# Altium project ECU V1.0 B.PrjPcb (part 6 of 9)
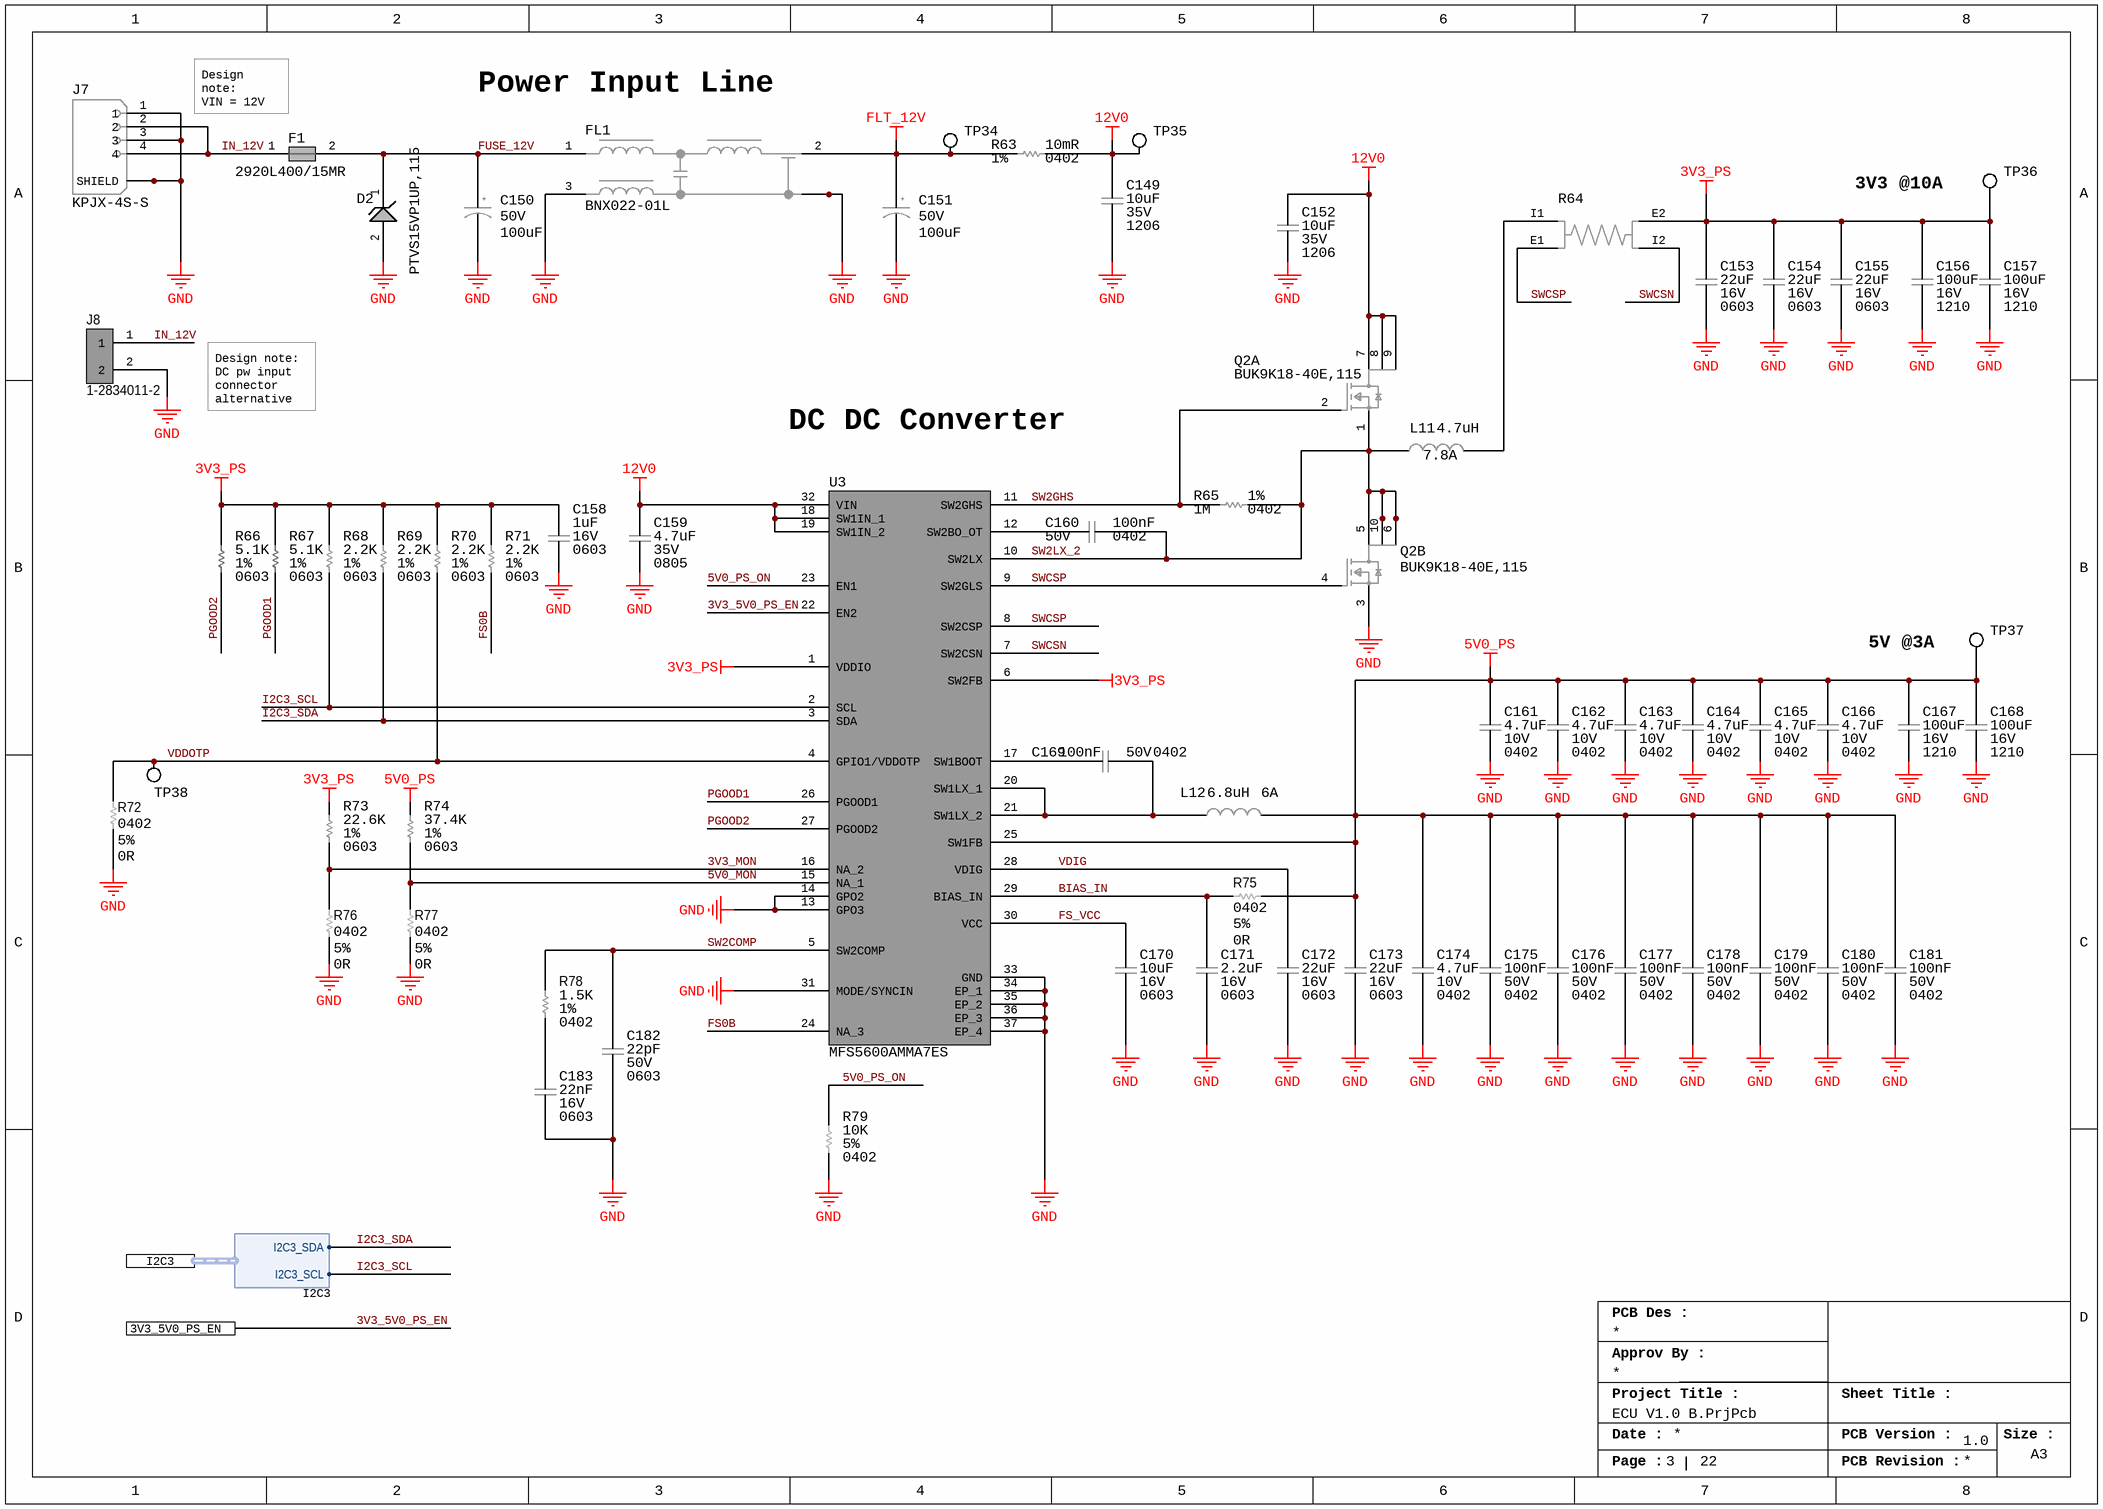
[diagram p16: 02_PWR IN.SchDoc]

## Sheet 02_PWR IN.SchDoc (continued)

### Library data of the parts (continued)
R74 = RES_37.4K_1%_100mW_0603: SMD Chip Resistor, 37.4 kOhm, ± 1%, 100 mW, 0603 [1608 Metric], Thick Film, General Purpose; Manufacturer: Yageo; Power Rating: 100mW; Voltage Rating: 50V; Temperature Coefficient: 100ppm/°C; Supplier 1: Digikey; Manufacturer Part Number: RC0603FR-0737K4L; RoHS: Yes; Category: Chip SMD Resistors; Stock 1: 85298; Pricing 1: 1=0.1, 10=0.009, 100=0.0071, 1000=0.00612 (USD); Case Code (Metric): 1608; Case Code (Imperial): 0603; Size Code: 0603; Min Operating Temperature: -55°C; Max Operating Temperature: 155°C; Package Quantity: 1; Packaging: Tape and Reel; Number of Terminations: 2; Termination: SMD/SMT; Max Power Dissipation: 100mW; Voltage Rating (DC): 50V; Features: Moisture Resistant; Series: RC; Length: 0.063inch; Width: 0.031inch; Height: 0.022inch; Lead Free: Lead Free; RoHS Compliant: Yes; ComponentLink1URL: https://datasheet.ciiva.com/2455/pyu-r-int-thick-7-2455137.pdf?src-supplier=Digikey; ComponentLink1Description: https://datasheet.ciiva.com/2455/pyu-r-int-thick-7-2455137.pdf?src-supplier=Digikey; ComponentLink2URL: https://datasheet.ciiva.com/2455/pyu-r-int-thick-7-2455138.pdf?src-supplier=Digikey; ComponentLink2Description: https://datasheet.ciiva.com/2455/pyu-r-int-thick-7-2455138.pdf?src-supplier=Digikey; ComponentLink3URL: https://datasheet.ciiva.com/2455/pyu-r-int-thick-7-2455139.pdf?src-supplier=Digikey; ComponentLink3Description: https://datasheet.ciiva.com/2455/pyu-r-int-thick-7-2455139.pdf?src-supplier=Digikey; Supplier Part Number 1: 311-37.4KHRDKR-ND
R78 = RES_1.5K_1%_63mW_0402: Res Thick Film 0402 1.5K Ohm 1% 1/16W ±100ppm/°C Molded SMD SMD Paper Tape on Plastic Reel; Manufacturer: Bourns; Power Rating: 62.5mW; Voltage Rating: 50V; Max Power Dissipation: 63mW; Supplier 1: Digi-Key; Manufacturer Part Number: CR0402-FX-1501GLF; RoHS: Yes; Category: Chip SMD Resistors; Stock 1: 177147; Pricing 1: 1=0.1, 10=0.011, 50=0.0064, 100=0.0051, 500=0.00326, 1000=0.00275, 5000=0.0019 (USD); Mount: Surface Mount; Case Code (Metric): 1005; Case Code (Imperial): 0402; Contact Plating: Tin; Min Operating Temperature: -55°C; Max Operating Temperature: 125°C; Package Quantity: 10000; Packaging: Tape and Reel; Number of Terminations: 2; Termination: SMD/SMT; Temperature Coefficient: 100ppm/°C; Series: CR0402; Voltage Rating (DC): 50V; Length: 0.039inch; Width: 0.5mm; Height: 0.016inch; Thickness: 356um; Radiation Hardening: No; RoHS Compliant: Yes; ComponentLink1URL: https://datasheet.ciiva.com/9123/cr0402-9123423.pdf?src-supplier=Avnet; ComponentLink1Description: https://datasheet.ciiva.com/9123/cr0402-9123423.pdf?src-supplier=Avnet; ComponentLink2URL: https://datasheet.ciiva.com/30173/cr0402-30173227.pdf?src-supplier=Onlinecomponents.com; ComponentLink2Description: https://datasheet.ciiva.com/30173/cr0402-30173227.pdf?src-supplier=Onlinecomponents.com; Supplier Part Number 1: CR0402-FX-1501GLFCT-ND
R79 = RES_10K_5%_100mW_0402: Res Thick Film 0402 10K Ohm 5% 1/10W ±200ppm/°C Molded SMD Punched Carrier T/R; Manufacturer: Panasonic; Power Rating: 100mW; Voltage Rating: 50V; Supplier 1: Digi-Key; Manufacturer Part Number: ERJ-2GEJ103X; RoHS: Yes; Category: Chip SMD Resistors; Stock 1: 4696986; Pricing 1: 1=0.1, 10=0.021, 50=0.0132, 100=0.011, 500=0.00744, 1000=0.00639, 5000=0.00464 (USD); Mount: Surface Mount; Contact Plating: Tin; Case Code (Metric): 1005; Case Code (Imperial): 0402; Size Code: 0402; Min Operating Temperature: -55°C; Max Operating Temperature: 155°C; Temperature Coefficient: 200ppm/°C; Packaging: Cut Tape; Resistor Type: Thick Film; Package Quantity: 10000; Number of Terminations: 2; Termination: SMD/SMT; Max Power Dissipation: 100mW; Features: Automotive AEC-Q200; Series: ERJ; Resistance Tolerance: 5%; Technology: THICK FILM; Voltage Rating (DC): 50V; Length: 1mm; Width: 0.5mm; Height: 0.35mm; Depth: 0.5mm; Ratings: AEC-Q200; Radiation Hardening: No; Reach SVHC Compliant: No; RoHS Compliant: Yes; Lead Free: 5697LeadFree; ComponentLink1URL: https://datasheet.ciiva.com/27055/1935721-27055112.pdf?src-supplier=Jameco; ComponentLink1Description: https://datasheet.ciiva.com/27055/1935721-27055112.pdf?src-supplier=Jameco; ComponentLink2URL: https://datasheet.ciiva.com/11821/0900766b80f806dd-11821170.pdf?src-supplier=Rs; ComponentLink2Description: https://datasheet.ciiva.com/11821/0900766b80f806dd-11821170.pdf?src-supplier=Rs; ComponentLink3URL: https://datasheet.ciiva.com/43460/1678796-43460391.pdf?src-supplier=Farnell; ComponentLink3Description: https://datasheet.ciiva.com/43460/1678796-43460391.pdf?src-supplier=Farnell; ComponentLink4URL: https://datasheet.ciiva.com/22785/1678796-22785949.pdf?src-supplier=Farnell; ComponentLink4Description: https://datasheet.ciiva.com/22785/1678796-22785949.pdf?src-supplier=Farnell; ComponentLink5URL: https://datasheet.ciiva.com/46371/1678796-46371910.pdf?src-supplier=Element14; ComponentLink5Description: https://datasheet.ciiva.com/46371/1678796-46371910.pdf?src-supplier=Element14; ComponentLink6URL: https://datasheet.ciiva.com/28514/1678796-28514154.pdf?src-supplier=Element14; ComponentLink6Description: https://datasheet.ciiva.com/28514/1678796-28514154.pdf?src-supplier=Element14; ComponentLink7URL: https://datasheet.ciiva.com/24070/aoa0000ce1-37422-24070679.pdf?src-supplier=Mouser; ComponentLink7Description: https://datasheet.ciiva.com/24070/aoa0000ce1-37422-24070679.pdf?src-supplier=Mouser; ComponentLink8URL: https://datasheet.ciiva.com/16767/70260739-16767130.pdf?src-supplier=Allied+Electronics; ComponentLink8Description: https://datasheet.ciiva.com/16767/70260739-16767130.pdf?src-supplier=Allied+Electronics; ComponentLink9URL: https://datasheet.ciiva.com/16774/70260739-16774504.pdf?src-supplier=Allied+Electronics; ComponentLink9Description: https://datasheet.ciiva.com/16774/70260739-16774504.pdf?src-supplier=Allied+Electronics; ComponentLink10URL: https://datasheet.ciiva.com/9194/aoa0000ce1-9194140.pdf?src-supplier=Avnet; ComponentLink10Description: https://datasheet.ciiva.com/9194/aoa0000ce1-9194140.pdf?src-supplier=Avnet; Supplier Part Number 1: P10KJCT-ND
TP34-TP38 = TP_PAD_SMD_SMALL: Test Point, SMD pad, round, 1.5mm, 1.6mm, 3mm diameter
U3 = IC_REG_BUCK_MFS5600AMMA7ES: Power Management, 36 V, 2 Step-Down DC-DC Converters, 2 Regulated Outputs, 32 Pins, HVQFN-EP; Manufacturer: NXP Semiconductors; Supplier 1: Digikey; Manufacturer Part Number: MFS5600AMMA7ES; RoHS: No; Category: Power Management ICs; Stock 1: 26; Pricing 1: 1=4.59, 10=3.486, 25=3.21, 100=2.9069, 490=2.67757, 980=2.60545, 1470=2.56933, 2940=2.51636 (USD); Supplier Part Number 1: 568-MFS5600AMMA7ES-ND

## Sheet 07_iMX 8X_LPDDR4.SchDoc
size A3; SheetNumber: 8; SheetTotal: 22
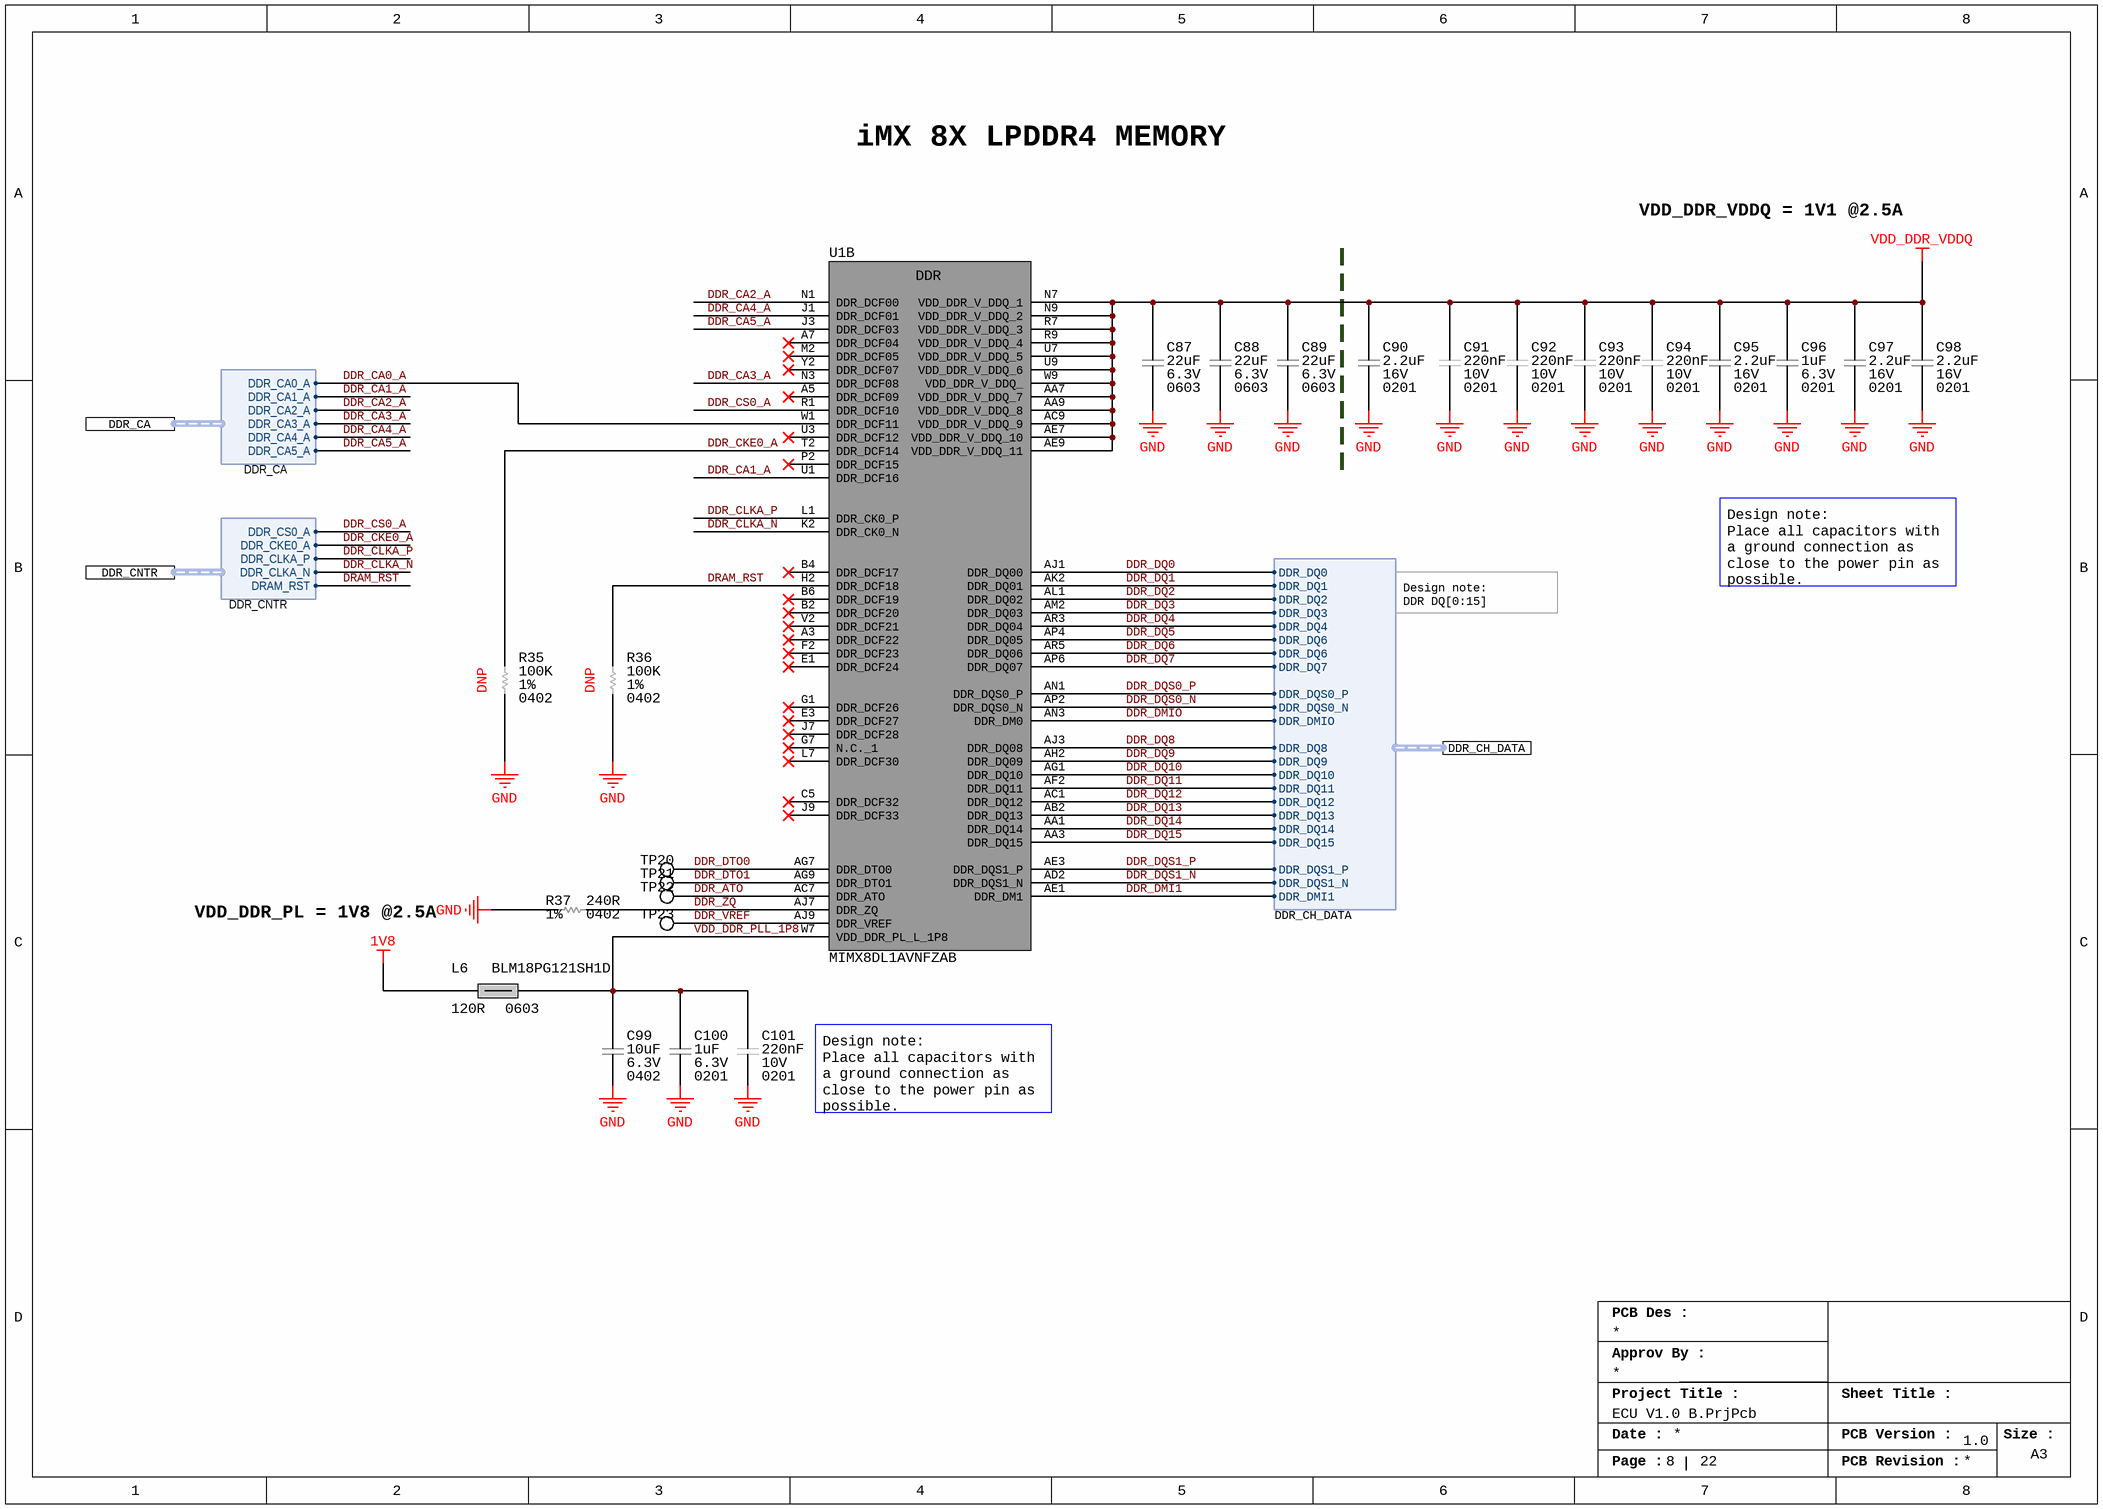
[diagram p6: 07_iMX 8X_LPDDR4.SchDoc]

### Parts
C87  Voltage Rating: 6.3V  Capacitance: 22uF  Case/Package: 0603  [CAP_0603_CAPC1608X08N]  (hidden comment: GRM188R60J226MEA0D)
C88  Voltage Rating: 6.3V  Capacitance: 22uF  Case/Package: 0603  [CAP_0603_CAPC1608X08N]  (hidden comment: GRM188R60J226MEA0D)
C89  Voltage Rating: 6.3V  Capacitance: 22uF  Case/Package: 0603  [CAP_0603_CAPC1608X08N]  (hidden comment: GRM188R60J226MEA0D)
C90  Capacitance: 2.2uF  Voltage Rating: 16V  Case/Package: 0201  [CAP_0201_CAPC0603X03N]  (hidden comment: GRM035R61C225ME01D)
C91  Voltage Rating (DC): 10V  Capacitance: 220nF  Case/Package: 0201  [CAP_0201_CAPC0603X03N]  (hidden comment: LMK063BJ224MP-F)
C92  Voltage Rating (DC): 10V  Capacitance: 220nF  Case/Package: 0201  [CAP_0201_CAPC0603X03N]  (hidden comment: LMK063BJ224MP-F)
C93  Voltage Rating (DC): 10V  Capacitance: 220nF  Case/Package: 0201  [CAP_0201_CAPC0603X03N]  (hidden comment: LMK063BJ224MP-F)
C94  Voltage Rating (DC): 10V  Capacitance: 220nF  Case/Package: 0201  [CAP_0201_CAPC0603X03N]  (hidden comment: LMK063BJ224MP-F)
C95  Capacitance: 2.2uF  Voltage Rating: 16V  Case/Package: 0201  [CAP_0201_CAPC0603X03N]  (hidden comment: GRM035R61C225ME01D)
C96  Voltage Rating (DC): 6.3V  Capacitance: 1uF  Case/Package: 0201  [CAP_0201_CAPC0603X03N]  (hidden comment: 02016D105MAT2A)
C97  Capacitance: 2.2uF  Voltage Rating: 16V  Case/Package: 0201  [CAP_0201_CAPC0603X03N]  (hidden comment: GRM035R61C225ME01D)
C98  Capacitance: 2.2uF  Voltage Rating: 16V  Case/Package: 0201  [CAP_0201_CAPC0603X03N]  (hidden comment: GRM035R61C225ME01D)
C99  Case/Package: 0402  Capacitance: 10uF  Voltage Rating: 6.3V  [CAP_0402_CAPC1005X05N]  (hidden comment: CL05A106MQ5NUNC)
C100  Voltage Rating (DC): 6.3V  Capacitance: 1uF  Case/Package: 0201  [CAP_0201_CAPC0603X03N]  (hidden comment: 02016D105MAT2A)
C101  Voltage Rating (DC): 10V  Capacitance: 220nF  Case/Package: 0201  [CAP_0201_CAPC0603X03N]  (hidden comment: LMK063BJ224MP-F)
L6  BLM18PG121SH1D  Impedance: 120R  Case/Package: 0603  [IND_0603_INDC1608X08N]
R35  Resistance: 100K  Tolerance: 1%  Case/Package: 0402  [RES_0402_RESC1005X04N]  (hidden comment: RC0402FR-07100KL)
R36  Resistance: 100K  Tolerance: 1%  Case/Package: 0402  [RES_0402_RESC1005X04N]  (hidden comment: RC0402FR-07100KL)
R37  Tolerance: 1%  Resistance: 240R  Case/Package: 0402  [RES_0402_RESC1005X04N]  (hidden comment: RC0402FR-07240RL)
TP20  NO COMPONENT  [TP_PAD_0.5MM_SMD_ROUND]  (value not drawn)  (no BOM)
TP21  NO COMPONENT  [TP_PAD_0.5MM_SMD_ROUND]  (value not drawn)  (no BOM)
TP22  NO COMPONENT  [TP_PAD_0.5MM_SMD_ROUND]  (value not drawn)  (no BOM)
TP23  NO COMPONENT  [TP_PAD_0.5MM_SMD_ROUND]  (value not drawn)  (no BOM)
U1  MIMX8DL1AVNFZAB  [MIMX8DL1AVNFZAB]  (part B of 15)

### Ports
DDR_CA (harness DDR_CA), DDR_CH_DATA (harness DDR_CH_DATA), DDR_CNTR (harness DDR_CNTR)

### Harnesses
DDR_CH_DATA: DDR_DQ0, DDR_DQ1, DDR_DQ2, DDR_DQ3, DDR_DQ4, DDR_DQ6, DDR_DQ6, DDR_DQ7, DDR_DQS0_P, DDR_DQS0_N, DDR_DMIO, DDR_DQ8, DDR_DQ9, DDR_DQ10, DDR_DQ11, DDR_DQ12, DDR_DQ13, DDR_DQ14, DDR_DQ15, DDR_DQS1_P, DDR_DQS1_N, DDR_DMI1
DDR_CA: DDR_CA0_A, DDR_CA1_A, DDR_CA2_A, DDR_CA3_A, DDR_CA4_A, DDR_CA5_A
DDR_CNTR: DDR_CS0_A, DDR_CKE0_A, DDR_CLKA_P, DDR_CLKA_N, DRAM_RST

### Nets
1V8: L6.1
GND: C87.1 C88.1 C89.1 C90.1 C91.1 C92.1 C93.1 C94.1 C95.1 C96.1 C97.1 C98.1 C99.1 C100.1 C101.1 R35.1 R36.1 R37.1
VDD_DDR_VDDQ: C87.2 C88.2 C89.2 C90.2 C91.2 C92.2 C93.2 C94.2 C95.2 C96.2 C97.2 C98.2 U1.AA7(VDD_DDR_V_DDQ_7) U1.AA9(VDD_DDR_V_DDQ_8) U1.AC9(VDD_DDR_V_DDQ_9) U1.AE7(VDD_DDR_V_DDQ_10) U1.AE9(VDD_DDR_V_DDQ_11) U1.N7(VDD_DDR_V_DDQ_1) U1.N9(VDD_DDR_V_DDQ_2) U1.R7(VDD_DDR_V_DDQ_3) U1.R9(VDD_DDR_V_DDQ_4) U1.U7(VDD_DDR_V_DDQ_5) U1.U9(VDD_DDR_V_DDQ_6) U1.W9(VDD_DDR_V_DDQ_)
DDR_ATO: TP22.1 U1.AC7(DDR_ATO)
DDR_CA0_A: U1.W1(DDR_DCF11) ; port DDR_CA.DDR_CA0_A
DDR_CA1_A: U1.U1(DDR_DCF16) ; port DDR_CA.DDR_CA1_A
DDR_CA2_A: U1.N1(DDR_DCF00) ; port DDR_CA.DDR_CA2_A
DDR_CA3_A: U1.N3(DDR_DCF08) ; port DDR_CA.DDR_CA3_A
DDR_CA4_A: U1.J1(DDR_DCF01) ; port DDR_CA.DDR_CA4_A
DDR_CA5_A: U1.J3(DDR_DCF03) ; port DDR_CA.DDR_CA5_A
DDR_CKE0_A: R35.2 U1.T2(DDR_DCF14) ; port DDR_CNTR.DDR_CKE0_A
DDR_CLKA_N: U1.K2(DDR_CK0_N) ; port DDR_CNTR.DDR_CLKA_N
DDR_CLKA_P: U1.L1(DDR_CK0_P) ; port DDR_CNTR.DDR_CLKA_P
DDR_CS0_A: U1.R1(DDR_DCF10) ; port DDR_CNTR.DDR_CS0_A
DDR_DMI1: U1.AE1(DDR_DM1) ; port DDR_CH_DATA.DDR_DMI1
DDR_DMIO: U1.AN3(DDR_DM0) ; port DDR_CH_DATA.DDR_DMIO
DDR_DQ0: U1.AJ1(DDR_DQ00) ; port DDR_CH_DATA.DDR_DQ0
DDR_DQ1: U1.AK2(DDR_DQ01) ; port DDR_CH_DATA.DDR_DQ1
DDR_DQ2: U1.AL1(DDR_DQ02) ; port DDR_CH_DATA.DDR_DQ2
DDR_DQ3: U1.AM2(DDR_DQ03) ; port DDR_CH_DATA.DDR_DQ3
DDR_DQ4: U1.AR3(DDR_DQ04) ; port DDR_CH_DATA.DDR_DQ4
DDR_DQ5: U1.AP4(DDR_DQ05) U1.AR5(DDR_DQ06) ; port DDR_CH_DATA.DDR_DQ6  [also labelled DDR_DQ6]
DDR_DQ7: U1.AP6(DDR_DQ07) ; port DDR_CH_DATA.DDR_DQ7
DDR_DQ8: U1.AJ3(DDR_DQ08) ; port DDR_CH_DATA.DDR_DQ8
DDR_DQ9: U1.AH2(DDR_DQ09) ; port DDR_CH_DATA.DDR_DQ9
DDR_DQ10: U1.AG1(DDR_DQ10) ; port DDR_CH_DATA.DDR_DQ10
DDR_DQ11: U1.AF2(DDR_DQ11) ; port DDR_CH_DATA.DDR_DQ11
DDR_DQ12: U1.AC1(DDR_DQ12) ; port DDR_CH_DATA.DDR_DQ12
DDR_DQ13: U1.AB2(DDR_DQ13) ; port DDR_CH_DATA.DDR_DQ13
DDR_DQ14: U1.AA1(DDR_DQ14) ; port DDR_CH_DATA.DDR_DQ14
DDR_DQ15: U1.AA3(DDR_DQ15) ; port DDR_CH_DATA.DDR_DQ15
DDR_DQS0_N: U1.AP2(DDR_DQS0_N) ; port DDR_CH_DATA.DDR_DQS0_N
DDR_DQS0_P: U1.AN1(DDR_DQS0_P) ; port DDR_CH_DATA.DDR_DQS0_P
DDR_DQS1_N: U1.AD2(DDR_DQS1_N) ; port DDR_CH_DATA.DDR_DQS1_N
DDR_DQS1_P: U1.AE3(DDR_DQS1_P) ; port DDR_CH_DATA.DDR_DQS1_P
DDR_DTO0: TP20.1 U1.AG7(DDR_DTO0)
DDR_DTO1: TP21.1 U1.AG9(DDR_DTO1)
DDR_VREF: TP23.1 U1.AJ9(DDR_VREF)
DDR_ZQ: R37.2 U1.AJ7(DDR_ZQ)
DRAM_RST: R36.2 U1.H2(DDR_DCF18) ; port DDR_CNTR.DRAM_RST
VDD_DDR_PLL_1P8: C99.2 C100.2 C101.2 L6.2 U1.W7(VDD_DDR_PL_L_1P8)

Not connected (* = marked no-connect by the designer): U1 A3(DDR_DCF22)* A5(DDR_DCF09)* A7(DDR_DCF04)* B2(DDR_DCF20)* B4(DDR_DCF17)* B6(DDR_DCF19)* C5(DDR_DCF32)* E1(DDR_DCF24)* E3(DDR_DCF27)* F2(DDR_DCF23)* G1(DDR_DCF26)* G7(N.C._1)* J7(DDR_DCF28)* J9(DDR_DCF33)* L7(DDR_DCF30)* M2(DDR_DCF05)* P2(DDR_DCF15)* U3(DDR_DCF12)* V2(DDR_DCF21)* Y2(DDR_DCF07)*

### Notes on the sheet
- iMX 8X LPDDR4 MEMORY
- VDD_DDR_VDDQ = 1V1 @2.5A
- Design note:
  Place all capacitors with a ground connection as close to the power pin as possible.
- Design note:
  DDR DQ[0:15]
- (near R35) DNP
- (near R36) DNP
- VDD_DDR_PL = 1V8 @2.5A
- PCB Des :
- Approv By :
- Project Title :
- Sheet Title :
- Date :
- PCB Version :
- Size :
- A3
- Page :
- PCB Revision :
- (in symbol IC_MPU_ARM_1.2GHz_MIMX8DL1AVNFZAB, part B) DDR

### Library data of the parts
C87-C89 = CAP_22uF_6.3V_X5R_0603: Multilayer Ceramic Capacitor, 22 uF, 6.3 V, ï¿½ 20%, X5R, 0603 [1608 Metric]; Manufacturer: Murata; Supplier 1: Digikey; Manufacturer Part Number: GRM188R60J226MEA0D; RoHS: Yes; Category: Ceramic Capacitors; Stock 1: 4736669; Pricing 1: 1=0.2, 10=0.113, 50=0.0794, 100=0.069, 500=0.05144, 1000=0.04599 (USD); Mount: Surface Mount; Number of Pins: 2; Case Code (Metric): 1608; Case Code (Imperial): 0603; Weight: 0.000222oz; Material: Ceramic; Min Operating Temperature: -55°C; Max Operating Temperature: 85°C; Packaging: Tape and Reel; Package Quantity: 1; Series: GRM; Tolerance: 20%; Dielectric: X5R; Termination: SMD/SMT; Voltage Rating (DC): 6.3V; Length: 0.063inch; Width: 0.031inch; Height: 0.8mm; Thickness: 0.039inch; Lead Free: Lead Free; RoHS Compliant: Yes; Reach SVHC Compliant: No; ComponentLink1URL: https://datasheet.ciiva.com/29540/partnumbering-e-01-29540441.pdf?src-supplier=Digikey; ComponentLink1Description: https://datasheet.ciiva.com/29540/partnumbering-e-01-29540441.pdf?src-supplier=Digikey; ComponentLink2URL: https://datasheet.ciiva.com/29540/partnumbering-e-01-29540442.pdf?src-supplier=Digikey; ComponentLink2Description: https://datasheet.ciiva.com/29540/partnumbering-e-01-29540442.pdf?src-supplier=Digikey; ComponentLink3URL: https://datasheet.ciiva.com/29540/partnumbering-e-01-29540443.pdf?src-supplier=Digikey; ComponentLink3Description: https://datasheet.ciiva.com/29540/partnumbering-e-01-29540443.pdf?src-supplier=Digikey; Supplier Part Number 1: 490-7611-1-ND
C90 C95 C97 C98 = CAP_2.2uF_16V_X5R_0201: General Up to 85C Reflow soldering; Manufacturer: Murata; Material: Ceramic; Dielectric: X5R; Tolerance: 20%; Supplier 1: Digikey; Manufacturer Part Number: GRM035R61C225ME01D; RoHS: No; Category: Ceramic Capacitors; Stock 1: 18674; Pricing 1: 1=0.36, 10=0.233, 50=0.1636, 100=0.1321, 500=0.09814, 1000=0.08587, 2500=0.08178, 5000=0.07565 (USD); Min Operating Temperature: -55°C; Max Operating Temperature: 85°C; Voltage Rating (DC): 16V; Length: 600um; Width: 300um; Height: 550um; Thickness: 500um; RoHS Compliant: Yes; ComponentLink1URL: https://datasheet.octopart.com/GRM035R61C225ME01D-Murata-datasheet-165579666.pdf?src-supplier=TME; ComponentLink1Description: https://datasheet.octopart.com/GRM035R61C225ME01D-Murata-datasheet-165579666.pdf?src-supplier=TME; Supplier Part Number 1: 490-GRM035R61C225ME01DCT-ND
C91-C94 C101 = CAP_0.22UF_10V_X5R_0201: as C201-C204 on sheet 16_LPDDR; Supplier 1: Digikey; Manufacturer Part Number: LMK063BJ224MP-F; RoHS: Yes; Category: Ceramic Capacitors; Stock 1: 6053224; Pricing 1: 1=0.12, 10=0.08, 50=0.0478, 100=0.0375, 500=0.02772, 1000=0.02295, 2500=0.02136, 5000=0.01954 (USD); Mount: Surface Mount; Case Code (Metric): 0603; Case Code (Imperial): 0201; Min Operating Temperature: -55°C; Max Operating Temperature: 85°C; Voltage Rating: 10V; Packaging: Tape and Reel; Package Quantity: 15000; Dielectric: X5R; Termination: SMD/SMT; Voltage: 10V; Series: M; Construction: Flat; Length: 0.6mm; Width: 0.3mm; Height: 0.3mm; Depth: 0.3mm; Radiation Hardening: No; Halogen Free: Halogen Free; RoHS Compliant: Yes; Reach SVHC Compliant: Unknown; ComponentLink1URL: https://datasheet.ciiva.com/134/lmk063bj224mp-f-ss-134995.pdf?src-supplier=Digikey; ComponentLink1Description: https://datasheet.ciiva.com/134/lmk063bj224mp-f-ss-134995.pdf?src-supplier=Digikey; ComponentLink2URL: https://datasheet.ciiva.com/11464/lmk063bj224mp-f-ss-11464053.pdf?src-supplier=Avnet; ComponentLink2Description: https://datasheet.ciiva.com/11464/lmk063bj224mp-f-ss-11464053.pdf?src-supplier=Avnet; ComponentLink3URL: https://datasheet.ciiva.com/15921/1589lmk063bj224mp-f-15921250.pdf?src-supplier=Onlinecomponents.com; ComponentLink3Description: https://datasheet.ciiva.com/15921/1589lmk063bj224mp-f-15921250.pdf?src-supplier=Onlinecomponents.com; ComponentLink4URL: https://datasheet.ciiva.com/26872/getdatasheetpartid-639019-26872592.pdf?src-supplier=Verical; ComponentLink4Description: https://datasheet.ciiva.com/26872/getdatasheetpartid-639019-26872592.pdf?src-supplier=Verical; ComponentLink5URL: https://datasheet.ciiva.com/30243/100lmk063bj224mp-f-30243150.pdf?src-supplier=Onlinecomponents.com; ComponentLink5Description: https://datasheet.ciiva.com/30243/100lmk063bj224mp-f-30243150.pdf?src-supplier=Onlinecomponents.com; ComponentLink6URL: https://datasheet.ciiva.com/28645/746258-28645141.pdf?src-supplier=Element14; ComponentLink6Description: https://datasheet.ciiva.com/28645/746258-28645141.pdf?src-supplier=Element14; ComponentLink7URL: https://datasheet.ciiva.com/5422/mlcc-all-e-541559-5422365.pdf?src-supplier=Mouser; ComponentLink7Description: https://datasheet.ciiva.com/5422/mlcc-all-e-541559-5422365.pdf?src-supplier=Mouser; Supplier Part Number 1: 587-2483-1-ND
C96 C100 = CAP_1UF_6.3V_X5R_0201: 0201 1 uF 6.3 V ±20 % Tolerance X5R Surface Mount Multilayer Ceramic Capacitor; Manufacturer: Kyocera AVX; Tolerance: 20%; Supplier 1: Mouser; Manufacturer Part Number: 02016D105MAT2A; RoHS: Yes; Category: Ceramic Capacitors; Stock 1: 1026413; Pricing 1: 1=0.1, 10=0.028, 50=0.028, 100=0.014, 1000=0.008, 10000=0.006 (USD); Mount: Surface Mount; Number of Pins: 2; Case Code (Metric): 0603; Case Code (Imperial): 0201; Min Operating Temperature: -55°C; Max Operating Temperature: 85°C; Packaging: Cut Tape; Series: -; Voltage Rating: 6.3V; Package Quantity: 1; Length: 0.024inch; Width: 0.012inch; Thickness: 0.013inch; Depth: 0.3mm; Lead Free: Lead Free; RoHS Compliant: Yes; Reach SVHC Compliant: No; ComponentLink1URL: https://datasheet.ciiva.com/6265/cx5r-6265595.pdf?src-supplier=Digi-Key; ComponentLink1Description: https://datasheet.ciiva.com/6265/cx5r-6265595.pdf?src-supplier=Digi-Key; ComponentLink2URL: https://datasheet.ciiva.com/1123/1666675-1123122.pdf?src-supplier=Element14; ComponentLink2Description: https://datasheet.ciiva.com/1123/1666675-1123122.pdf?src-supplier=Element14; ComponentLink3URL: https://datasheet.ciiva.com/14891/cx5r-14891029.pdf?src-supplier=Digi-Key; ComponentLink3Description: https://datasheet.ciiva.com/14891/cx5r-14891029.pdf?src-supplier=Digi-Key; ComponentLink4URL: https://datasheet.ciiva.com/7614/cx5r-7614682.pdf?src-supplier=Digi-Key; ComponentLink4Description: https://datasheet.ciiva.com/7614/cx5r-7614682.pdf?src-supplier=Digi-Key; ComponentLink5URL: https://datasheet.ciiva.com/14891/cx5r-14891030.pdf?src-supplier=Digi-Key; ComponentLink5Description: https://datasheet.ciiva.com/14891/cx5r-14891030.pdf?src-supplier=Digi-Key; Supplier Part Number 1: 581-02016D105MAT2A; Dielectric: X5R
C99 = CAP_10UF_6.3V_X5R_0402: Cap Ceramic 10uF 6.3V X5R 20% SMD 0402 85C T/R; Manufacturer: Samsung; Supplier 1: Digikey; Manufacturer Part Number: CL05A106MQ5NUNC; RoHS: Yes; Category: Ceramic Capacitors; Stock 1: 6097180; Pricing 1: 1=0.24, 10=0.153, 50=0.0968, 100=0.0774, 500=0.05588, 1000=0.04943, 2500=0.04728, 5000=0.04299 (USD); Mount: Surface Mount; Case Code (Metric): 1005; Case Code (Imperial): 0402; Min Operating Temperature: -55°C; Max Operating Temperature: 85°C; Packaging: Tape and Reel; Tolerance: 20%; Dielectric: X5R; Series: CL; Package Quantity: 1; Construction: Flat; Length: 1mm; Width: 0.02inch; Height: 0.5mm; Depth: 0.5mm; Thickness: 0.028inch; Radiation Hardening: No; RoHS Compliant: Yes; ComponentLink1URL: https://datasheet.ciiva.com/16437/cl05a106mq5nunc-16437356.pdf?src-supplier=Future+Electronics; ComponentLink1Description: https://datasheet.ciiva.com/16437/cl05a106mq5nunc-16437356.pdf?src-supplier=Future+Electronics; ComponentLink2URL: https://datasheet.ciiva.com/26877/getdatasheetpartid-355289-26877841.pdf?src-supplier=Verical; ComponentLink2Description: https://datasheet.ciiva.com/26877/getdatasheetpartid-355289-26877841.pdf?src-supplier=Verical; Supplier Part Number 1: 1276-1451-1-ND
L6 = IND_FERRITE_BEADS_120R_2A_0603_BLM18PG121SH1D: Ferrite Beads Multi-Layer 120Ohm 25% 100MHz 2A 50mOhm DCR 0603 Automotive Paper T/R; Manufacturer: Murata; Number of Lines: 1; Shielding: Unshielded; DC Resistance-Max: 50mR; Supplier 1: Digi-Key; Manufacturer Part Number: BLM18PG121SH1D; RoHS: Yes; Category: Ferrite Beads and Chips; Stock 1: 282143; Pricing 1: 1=0.11, 10=0.086, 25=0.0772, 50=0.0566, 100=0.0489, 250=0.03864, 500=0.03262, 1000=0.02747 (USD); Mount: Surface Mount; Case Code (Metric): 1608; Case Code (Imperial): 0603; Weight: 7.1E-05oz; Contact Plating: Tin,Matte; Material: Ferrite; Min Operating Temperature: -55°C; Max Operating Temperature: 125°C; Tolerance: 25%; Packaging: Tape and Reel; Package Quantity: 1; Current Rating: 2A; Max Current Rating: 2A; Termination: SMD/SMT; Max DC Current: 2A; Test Frequency: 100MHz; Number of Circuits: 1; Series: EMIFIL®, BLM18P; Length: 1.6mm; Width: 0.031inch; Height: 0.8mm; Depth: 0.8mm; Ratings: AEC-Q200; Lead Free: Lead Free; RoHS Compliant: Yes; ComponentLink1URL: https://datasheet.octopart.com/BLM18PG121SH1D-Murata-datasheet-141273661.pdf?src-supplier=Element14; ComponentLink1Description: https://datasheet.octopart.com/BLM18PG121SH1D-Murata-datasheet-141273661.pdf?src-supplier=Element14; ComponentLink2URL: https://datasheet.octopart.com/BLM18PG121SH1D-Murata-datasheet-62086335.pdf?src-supplier=Future+Electronics; ComponentLink2Description: https://datasheet.octopart.com/BLM18PG121SH1D-Murata-datasheet-62086335.pdf?src-supplier=Future+Electronics; ComponentLink3URL: http://search.murata.co.jp/Ceramy/image/img/PDF/ENG/L0132S0193BLM18P.pdf?src-supplier=Avnet; ComponentLink3Description: http://search.murata.co.jp/Ceramy/image/img/PDF/ENG/L0132S0193BLM18P.pdf?src-supplier=Avnet; ComponentLink4URL: https://www.murata.com/en-us/products/productdata/8796738650142/ENFA0003.pdf?src-supplier=Digi-Key; ComponentLink4Description: https://www.murata.com/en-us/products/productdata/8796738650142/ENFA0003.pdf?src-supplier=Digi-Key; Supplier Part Number 1: 490-7815-6-ND
R35 R36 = RES_100K_1%_100mW_0402: SMD Chip Resistor, 100 kOhm, ± 1%, 63 mW, 0402 [1005 Metric], Thick Film, General Purpose; Manufacturer: Yageo; Temperature Coefficient: 100ppm/°C; Power Rating: 63mW; Voltage Rating: 50V; Supplier 1: Digi-Key; Manufacturer Part Number: RC0402FR-07100KL; RoHS: Yes; Category: Chip SMD Resistors; Stock 1: 27579413; Pricing 1: 1=0.1, 10=0.014, 50=0.0084, 100=0.007, 500=0.00464, 1000=0.00396, 5000=0.00282 (USD); Case Code (Metric): 1005; Case Code (Imperial): 0402; Min Operating Temperature: -55°C; Max Operating Temperature: 155°C; Resistor Type: Thick Film; Packaging: Tape and Reel; Package Quantity: 1; Number of Terminations: 2; Termination: SMD/SMT; Max Power Dissipation: 63mW; Features: Moisture Resistant; Series: RC; Resistance Tolerance: 1%; Construction: Rectangular; Technology: THICK FILM; Voltage Rating (AC): 50V; Length: 0.039inch; Width: 0.02inch; Height: 0.016inch; Depth: 0.5mm; Reach SVHC Compliant: No; RoHS Compliant: Yes; Lead Free: 5697LeadFree; Military Standard: Not; ComponentLink1URL: https://datasheet.ciiva.com/11819/0900766b80c66297-11819452.pdf?src-supplier=Rs; ComponentLink1Description: https://datasheet.ciiva.com/11819/0900766b80c66297-11819452.pdf?src-supplier=Rs; ComponentLink2URL: https://datasheet.ciiva.com/22747/1018594-22747509.pdf?src-supplier=Element14; ComponentLink2Description: https://datasheet.ciiva.com/22747/1018594-22747509.pdf?src-supplier=Element14; ComponentLink3URL: https://datasheet.ciiva.com/2453/pyu-r-int-thick-7-2453362.pdf?src-supplier=Digi-Key; ComponentLink3Description: https://datasheet.ciiva.com/2453/pyu-r-int-thick-7-2453362.pdf?src-supplier=Digi-Key; ComponentLink4URL: https://datasheet.ciiva.com/12667/pyu-rc0402-51-rohs-l-6-r-12667930.pdf?src-supplier=Mouser; ComponentLink4Description: https://datasheet.ciiva.com/12667/pyu-rc0402-51-rohs-l-6-r-12667930.pdf?src-supplier=Mouser; ComponentLink5URL: https://datasheet.ciiva.com/15189/getdatasheetpartid-323696-15189334.pdf?src-supplier=Verical; ComponentLink5Description: https://datasheet.ciiva.com/15189/getdatasheetpartid-323696-15189334.pdf?src-supplier=Verical; ComponentLink6URL: https://datasheet.ciiva.com/2453/pyu-r-int-thick-7-2453363.pdf?src-supplier=Digi-Key; ComponentLink6Description: https://datasheet.ciiva.com/2453/pyu-r-int-thick-7-2453363.pdf?src-supplier=Digi-Key; ComponentLink7URL: https://datasheet.ciiva.com/2453/pyu-r-int-thick-7-2453361.pdf?src-supplier=Digi-Key; ComponentLink7Description: https://datasheet.ciiva.com/2453/pyu-r-int-thick-7-2453361.pdf?src-supplier=Digi-Key; Supplier Part Number 1: 311-100KLRCT-ND
R37 = RES_240R_1%_63mW_0402: SMD Chip Resistor, 240 Ohm, ± 1%, 63 mW, 0402 [1005 Metric], Thick Film, General Purpose; Manufacturer: Yageo; Power Rating: 63mW; Voltage Rating: 50V; Temperature Coefficient: 100ppm/°C; Supplier 1: Digi-Key; Manufacturer Part Number: RC0402FR-07240RL; RoHS: Yes; Category: Chip SMD Resistors; Stock 1: 1880273; Pricing 1: 1=0.1, 10=0.014, 50=0.0084, 100=0.007, 500=0.00464, 1000=0.00396, 5000=0.00282 (USD); Case Code (Metric): 1005; Case Code (Imperial): 0402; Size Code: 0402; Min Operating Temperature: -55°C; Max Operating Temperature: 155°C; Resistor Type: Thick Film; Packaging: Tape and Reel; Number of Terminations: 2; Termination: SMD/SMT; Max Power Dissipation: 63mW; Voltage Rating (DC): 50V; Features: Moisture Resistant; Series: RC; Construction: Rectangular; Resistance Tolerance: 1%; Length: 1mm; Depth: 0.5mm; RoHS Compliant: Yes; Military Standard: Not; Lead Free: Lead Free; Reach SVHC Compliant: Unknown; ComponentLink1URL: https://datasheet.ciiva.com/7849/1018594-7849915.pdf?src-supplier=Element14; ComponentLink1Description: https://datasheet.ciiva.com/7849/1018594-7849915.pdf?src-supplier=Element14; ComponentLink2URL: https://datasheet.ciiva.com/7849/1018594-7849916.pdf?src-supplier=Element14; ComponentLink2Description: https://datasheet.ciiva.com/7849/1018594-7849916.pdf?src-supplier=Element14; ComponentLink3URL: https://datasheet.ciiva.com/2519/pyu-r-int-thick-7-2519158.pdf?src-supplier=Digi-Key; ComponentLink3Description: https://datasheet.ciiva.com/2519/pyu-r-int-thick-7-2519158.pdf?src-supplier=Digi-Key; ComponentLink4URL: https://datasheet.ciiva.com/2519/pyu-r-int-thick-7-2519157.pdf?src-supplier=Digi-Key; ComponentLink4Description: https://datasheet.ciiva.com/2519/pyu-r-int-thick-7-2519157.pdf?src-supplier=Digi-Key; ComponentLink5URL: https://datasheet.ciiva.com/2519/pyu-r-int-thick-7-2519156.pdf?src-supplier=Digi-Key; ComponentLink5Description: https://datasheet.ciiva.com/2519/pyu-r-int-thick-7-2519156.pdf?src-supplier=Digi-Key; ComponentLink6URL: https://datasheet.ciiva.com/12669/pyu-rc0402-51-rohs-l-6-r-12669689.pdf?src-supplier=Mouser; ComponentLink6Description: https://datasheet.ciiva.com/12669/pyu-rc0402-51-rohs-l-6-r-12669689.pdf?src-supplier=Mouser; ComponentLink7URL: https://datasheet.ciiva.com/17419/pyu-rc0402-51-rohs-l-6-r-17419482.pdf?src-supplier=Future+Electronics; ComponentLink7Description: https://datasheet.ciiva.com/17419/pyu-rc0402-51-rohs-l-6-r-17419482.pdf?src-supplier=Future+Electronics; Supplier Part Number 1: 311-240LRCT-ND
TP20-TP23 = TP_PAD_SMD_SMALL: as TP34-TP38 on sheet 02_PWR IN
U1 = IC_MPU_ARM_1.2GHz_MIMX8DL1AVNFZAB: I.MX8 Dxl 15SQ / Tray Rohs Compliant: Yes; Manufacturer: NXP Semiconductors; Supplier 1: Mouser; Manufacturer Part Number: MIMX8DL1AVNFZAB; RoHS: No; Category: Uncategorized; Stock 1: 196; Pricing 1: 1=46.19, 10=40.26, 25=38.57, 50=38.56, 100=33.3, 252=33.16, 1000=33.3, 10000=33.3 (USD); Supplier Part Number 1: 771-MIMX8DL1AVNFZAB

## Sheet 10_iMX 8X_ETH.SchDoc
size A4; SheetNumber: 11; SheetTotal: 22
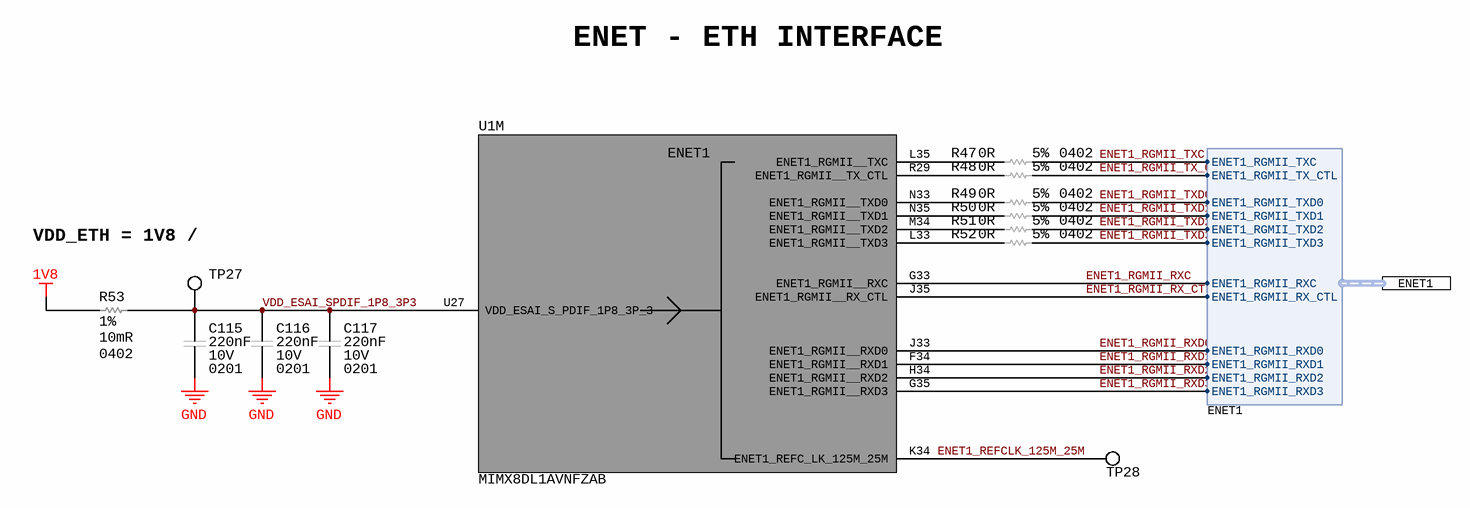
[diagram p7: 10_iMX 8X_ETH.SchDoc]

### Parts
C115  Voltage Rating (DC): 10V  Capacitance: 220nF  Case/Package: 0201  [CAP_0201_CAPC0603X03N]  (hidden comment: LMK063BJ224MP-F)
C116  Voltage Rating (DC): 10V  Capacitance: 220nF  Case/Package: 0201  [CAP_0201_CAPC0603X03N]  (hidden comment: LMK063BJ224MP-F)
C117  Voltage Rating (DC): 10V  Capacitance: 220nF  Case/Package: 0201  [CAP_0201_CAPC0603X03N]  (hidden comment: LMK063BJ224MP-F)
R47  Case Code (Imperial): 0402  Tolerance: 5%  Resistance: 0R  [RES_0402_RESC1005X04N]  (hidden comment: ERJ-2GE0R00X)
R48  Case Code (Imperial): 0402  Tolerance: 5%  Resistance: 0R  [RES_0402_RESC1005X04N]  (hidden comment: ERJ-2GE0R00X)
R49  Case Code (Imperial): 0402  Tolerance: 5%  Resistance: 0R  [RES_0402_RESC1005X04N]  (hidden comment: ERJ-2GE0R00X)
R50  Case Code (Imperial): 0402  Tolerance: 5%  Resistance: 0R  [RES_0402_RESC1005X04N]  (hidden comment: ERJ-2GE0R00X)
R51  Case Code (Imperial): 0402  Tolerance: 5%  Resistance: 0R  [RES_0402_RESC1005X04N]  (hidden comment: ERJ-2GE0R00X)
R52  Case Code (Imperial): 0402  Tolerance: 5%  Resistance: 0R  [RES_0402_RESC1005X04N]  (hidden comment: ERJ-2GE0R00X)
R53  Tolerance: 1%  Resistance: 10mR  Case/Package: 0402  [RES_0603_RESC1608X04N]  (hidden comment: ERJ-2LWFR010X)
TP27  NO COMPONENT  [TP_PAD_0.5MM_SMD_ROUND]  (value not drawn)  (no BOM)
TP28  NO COMPONENT  [TP_PAD_0.5MM_SMD_ROUND]  (value not drawn)  (no BOM)
U1  MIMX8DL1AVNFZAB  [MIMX8DL1AVNFZAB]  (part M of 15)

### Ports
ENET1 (harness ENET1)

### Harnesses
ENET1: ENET1_RGMII_TXC, ENET1_RGMII_TX_CTL, ENET1_RGMII_TXD0, ENET1_RGMII_TXD1, ENET1_RGMII_TXD2, ENET1_RGMII_TXD3, ENET1_RGMII_RXC, ENET1_RGMII_RX_CTL, ENET1_RGMII_RXD0, ENET1_RGMII_RXD1, ENET1_RGMII_RXD2, ENET1_RGMII_RXD3

### Nets
1V8: R53.1
GND: C115.1 C116.1 C117.1
ENET1_REFCLK_125M_25M: TP28.1 U1.K34(ENET1_REFC_LK_125M_25M)
ENET1_RGMII_RX_CTL: U1.J35(ENET1_RGMII__RX_CTL) ; port ENET1.ENET1_RGMII_RX_CTL
ENET1_RGMII_RXC: U1.G33(ENET1_RGMII__RXC) ; port ENET1.ENET1_RGMII_RXC
ENET1_RGMII_RXD0: U1.J33(ENET1_RGMII__RXD0) ; port ENET1.ENET1_RGMII_RXD0
ENET1_RGMII_RXD1: U1.F34(ENET1_RGMII__RXD1) ; port ENET1.ENET1_RGMII_RXD1
ENET1_RGMII_RXD2: U1.H34(ENET1_RGMII__RXD2) ; port ENET1.ENET1_RGMII_RXD2
ENET1_RGMII_RXD3: U1.G35(ENET1_RGMII__RXD3) ; port ENET1.ENET1_RGMII_RXD3
ENET1_RGMII_TX_CTL: R48.2 ; port ENET1.ENET1_RGMII_TX_CTL
ENET1_RGMII_TXC: R47.2 ; port ENET1.ENET1_RGMII_TXC
ENET1_RGMII_TXD0: R49.2 ; port ENET1.ENET1_RGMII_TXD0
ENET1_RGMII_TXD1: R50.2 ; port ENET1.ENET1_RGMII_TXD1
ENET1_RGMII_TXD2: R51.2 ; port ENET1.ENET1_RGMII_TXD2
ENET1_RGMII_TXD3: R52.2 ; port ENET1.ENET1_RGMII_TXD3
VDD_ESAI_SPDIF_1P8_3P3: C115.2 C116.2 C117.2 R53.2 TP27.1 U1.U27(VDD_ESAI_S_PDIF_1P8_3P_3)
NetR47_1: R47.1 U1.L35(ENET1_RGMII__TXC)
NetR48_1: R48.1 U1.R29(ENET1_RGMII__TX_CTL)
NetR49_1: R49.1 U1.N33(ENET1_RGMII__TXD0)
NetR50_1: R50.1 U1.N35(ENET1_RGMII__TXD1)
NetR51_1: R51.1 U1.M34(ENET1_RGMII__TXD2)
NetR52_1: R52.1 U1.L33(ENET1_RGMII__TXD3)

### Notes on the sheet
- ENET - ETH INTERFACE
- VDD_ETH = 1V8 / 2.5A
- PCB Des :
- Approv By :
- Project Title :
- Sheet Title :
- Date :
- PCB Version :
- Size :
- A4
- Page :
- PCB Revision :
- (in symbol IC_MPU_ARM_1.2GHz_MIMX8DL1AVNFZAB, part M) ENET1

### Library data of the parts
C115-C117 = CAP_0.22UF_10V_X5R_0201: as C201-C204 on sheet 16_LPDDR; Supplier 1: Digikey; Manufacturer Part Number: LMK063BJ224MP-F; RoHS: Yes; Category: Ceramic Capacitors; Stock 1: 6053224; Pricing 1: 1=0.12, 10=0.08, 50=0.0478, 100=0.0375, 500=0.02772, 1000=0.02295, 2500=0.02136, 5000=0.01954 (USD); Mount: Surface Mount; Case Code (Metric): 0603; Case Code (Imperial): 0201; Min Operating Temperature: -55°C; Max Operating Temperature: 85°C; Voltage Rating: 10V; Packaging: Tape and Reel; Package Quantity: 15000; Dielectric: X5R; Termination: SMD/SMT; Voltage: 10V; Series: M; Construction: Flat; Length: 0.6mm; Width: 0.3mm; Height: 0.3mm; Depth: 0.3mm; Radiation Hardening: No; Halogen Free: Halogen Free; RoHS Compliant: Yes; Reach SVHC Compliant: Unknown; ComponentLink1URL: https://datasheet.ciiva.com/134/lmk063bj224mp-f-ss-134995.pdf?src-supplier=Digikey; ComponentLink1Description: https://datasheet.ciiva.com/134/lmk063bj224mp-f-ss-134995.pdf?src-supplier=Digikey; ComponentLink2URL: https://datasheet.ciiva.com/11464/lmk063bj224mp-f-ss-11464053.pdf?src-supplier=Avnet; ComponentLink2Description: https://datasheet.ciiva.com/11464/lmk063bj224mp-f-ss-11464053.pdf?src-supplier=Avnet; ComponentLink3URL: https://datasheet.ciiva.com/15921/1589lmk063bj224mp-f-15921250.pdf?src-supplier=Onlinecomponents.com; ComponentLink3Description: https://datasheet.ciiva.com/15921/1589lmk063bj224mp-f-15921250.pdf?src-supplier=Onlinecomponents.com; ComponentLink4URL: https://datasheet.ciiva.com/26872/getdatasheetpartid-639019-26872592.pdf?src-supplier=Verical; ComponentLink4Description: https://datasheet.ciiva.com/26872/getdatasheetpartid-639019-26872592.pdf?src-supplier=Verical; ComponentLink5URL: https://datasheet.ciiva.com/30243/100lmk063bj224mp-f-30243150.pdf?src-supplier=Onlinecomponents.com; ComponentLink5Description: https://datasheet.ciiva.com/30243/100lmk063bj224mp-f-30243150.pdf?src-supplier=Onlinecomponents.com; ComponentLink6URL: https://datasheet.ciiva.com/28645/746258-28645141.pdf?src-supplier=Element14; ComponentLink6Description: https://datasheet.ciiva.com/28645/746258-28645141.pdf?src-supplier=Element14; ComponentLink7URL: https://datasheet.ciiva.com/5422/mlcc-all-e-541559-5422365.pdf?src-supplier=Mouser; ComponentLink7Description: https://datasheet.ciiva.com/5422/mlcc-all-e-541559-5422365.pdf?src-supplier=Mouser; Supplier Part Number 1: 587-2483-1-ND
R47-R52 = RES_0R_5%_100mW_0402: SMD Chip Resistor, Jumper, 0 ohm, 100 mW, 0402 [1005 Metric], Thick Film, General Purpose; Manufacturer: Panasonic; Power Rating: 100mW; Voltage Rating: 50V; Temperature Coefficient: 600ppm/°C; Supplier 1: Mouser; Manufacturer Part Number: ERJ-2GE0R00X; RoHS: Yes; Category: Chip SMD Resistors; Stock 1: 10989354; Pricing 1: 1=0.1, 10=0.013, 50=0.013, 100=0.006, 1000=0.004, 2500=0.003, 10000=0.003 (USD); Mount: Surface Mount; Case/Package: 0402; Contact Plating: Tin; Case Code (Metric): 1005; Size Code: 0402; Min Operating Temperature: -55°C; Max Operating Temperature: 155°C; Resistor Type: Thick Film; Packaging: Cut Tape; Package Quantity: 10000; Number of Terminations: 2; Termination: SMD/SMT; Max Power Dissipation: 100mW; Voltage Rating (DC): 50V; Features: Automotive AEC-Q200; Series: ERJ; Construction: Rectangular; Technology: THICK FILM; Length: 1mm; Width: 0.5mm; Height: 0.35mm; Depth: 0.5mm; Ratings: AEC-Q200; Radiation Hardening: No; Reach SVHC Compliant: No; Military Standard: Not; Lead Free: Lead Free; RoHS Compliant: Yes; ComponentLink1URL: https://datasheet.ciiva.com/11821/0900766b80f806dd-11821176.pdf?src-supplier=Rs; ComponentLink1Description: https://datasheet.ciiva.com/11821/0900766b80f806dd-11821176.pdf?src-supplier=Rs; ComponentLink2URL: https://datasheet.ciiva.com/43460/1678796-43460347.pdf?src-supplier=Farnell; ComponentLink2Description: https://datasheet.ciiva.com/43460/1678796-43460347.pdf?src-supplier=Farnell; ComponentLink3URL: https://datasheet.ciiva.com/46389/1678796-46389518.pdf?src-supplier=Element14; ComponentLink3Description: https://datasheet.ciiva.com/46389/1678796-46389518.pdf?src-supplier=Element14; ComponentLink4URL: https://datasheet.ciiva.com/5959/1678796-5959692.pdf?src-supplier=Farnell; ComponentLink4Description: https://datasheet.ciiva.com/5959/1678796-5959692.pdf?src-supplier=Farnell; ComponentLink5URL: https://datasheet.ciiva.com/28695/1678796-28695758.pdf?src-supplier=Element14; ComponentLink5Description: https://datasheet.ciiva.com/28695/1678796-28695758.pdf?src-supplier=Element14; ComponentLink6URL: https://datasheet.ciiva.com/16783/70260739-16783734.pdf?src-supplier=Allied+Electronics; ComponentLink6Description: https://datasheet.ciiva.com/16783/70260739-16783734.pdf?src-supplier=Allied+Electronics; ComponentLink7URL: https://datasheet.ciiva.com/16778/70260739-16778335.pdf?src-supplier=Allied+Electronics; ComponentLink7Description: https://datasheet.ciiva.com/16778/70260739-16778335.pdf?src-supplier=Allied+Electronics; ComponentLink8URL: https://datasheet.ciiva.com/48531/aoa0000ce1-48531077.pdf?src-supplier=Avnet; ComponentLink8Description: https://datasheet.ciiva.com/48531/aoa0000ce1-48531077.pdf?src-supplier=Avnet; ComponentLink9URL: https://datasheet.ciiva.com/30097/4aoa0000ce1-30097116.pdf?src-supplier=Onlinecomponents.com; ComponentLink9Description: https://datasheet.ciiva.com/30097/4aoa0000ce1-30097116.pdf?src-supplier=Onlinecomponents.com; Supplier Part Number 1: 667-ERJ-2GE0R00X
R53 = RES_10mR_1%_0.05W_0402: Res Current Sense Thick Film 0402 0.01 Ohm 1% 1/5W 0ppm/°C to 500ppm/°C Molded T/R; Manufacturer: Panasonic; Max Power Dissipation: 200mW; Supplier 1: Mouser; Manufacturer Part Number: ERJ-2LWFR010X; RoHS: Yes; Category: Chip SMD Resistors; Stock 1: 52793; Pricing 1: 1=0.24, 10=0.144, 50=0.13, 100=0.098, 500=0.08, 1000=0.071, 5000=0.061, 10000=0.056, 30000=0.056 (USD); Case Code (Metric): 1005; Case Code (Imperial): 0402; Min Operating Temperature: -55°C; Max Operating Temperature: 125°C; Packaging: Cut Tape; Temperature Coefficient: 500ppm/°C; Number of Terminations: 2; Features: Automotive AEC-Q200; Series: ERJ; Length: 0.039inch; Width: 0.02inch; Height: 0.018inch; RoHS Compliant: Yes; ComponentLink1URL: http://industrial.panasonic.com/cdbs/www-data/pdf/RDN0000/AOA0000C313.pdf?src-supplier=Farnell; ComponentLink1Description: http://industrial.panasonic.com/cdbs/www-data/pdf/RDN0000/AOA0000C313.pdf?src-supplier=Farnell; ComponentLink2URL: https://industrial.panasonic.com/cdbs/www-data/pdf/RDN0000/AOA0000C313.pdf?src-supplier=Digikey; ComponentLink2Description: https://industrial.panasonic.com/cdbs/www-data/pdf/RDN0000/AOA0000C313.pdf?src-supplier=Digikey; ComponentLink3URL: http://industrial.panasonic.com/cdbs/www-data/pdf/RDN0000/AOA0000C313.pdf?src-supplier=Element14; ComponentLink3Description: http://industrial.panasonic.com/cdbs/www-data/pdf/RDN0000/AOA0000C313.pdf?src-supplier=Element14; ComponentLink4URL: https://datasheet.octopart.com/ERJ2LWFR010X-Panasonic-datasheet-68299093.pdf?src-supplier=Future+Electronics; ComponentLink4Description: https://datasheet.octopart.com/ERJ2LWFR010X-Panasonic-datasheet-68299093.pdf?src-supplier=Future+Electronics; ComponentLink5URL: https://datasheet.octopart.com/ERJ2LWFR010X-Panasonic-datasheet-136473239.pdf?src-supplier=Newark; ComponentLink5Description: https://datasheet.octopart.com/ERJ2LWFR010X-Panasonic-datasheet-136473239.pdf?src-supplier=Newark; ComponentLink6URL: http://industrial.panasonic.com/cdbs/www-data/pdf/RDN0000/AOA0000C313.pdf?src-supplier=Newark; ComponentLink6Description: http://industrial.panasonic.com/cdbs/www-data/pdf/RDN0000/AOA0000C313.pdf?src-supplier=Newark; Supplier Part Number 1: 667-ERJ-2LWFR010X
TP27 TP28 = TP_PAD_SMD_SMALL: as TP34-TP38 on sheet 02_PWR IN
U1 = IC_MPU_ARM_1.2GHz_MIMX8DL1AVNFZAB: as U1 on sheet 07_iMX 8X_LPDDR4; Supplier 1: Mouser; Manufacturer Part Number: MIMX8DL1AVNFZAB; RoHS: No; Category: Uncategorized; Stock 1: 196; Pricing 1: 1=46.19, 10=40.26, 25=38.57, 50=38.56, 100=33.3, 252=33.16, 1000=33.3, 10000=33.3 (USD); Supplier Part Number 1: 771-MIMX8DL1AVNFZAB

## Sheet 11_iMX 8X_SPI & ADC.SchDoc
size A3; SheetNumber: 12; SheetTotal: 22
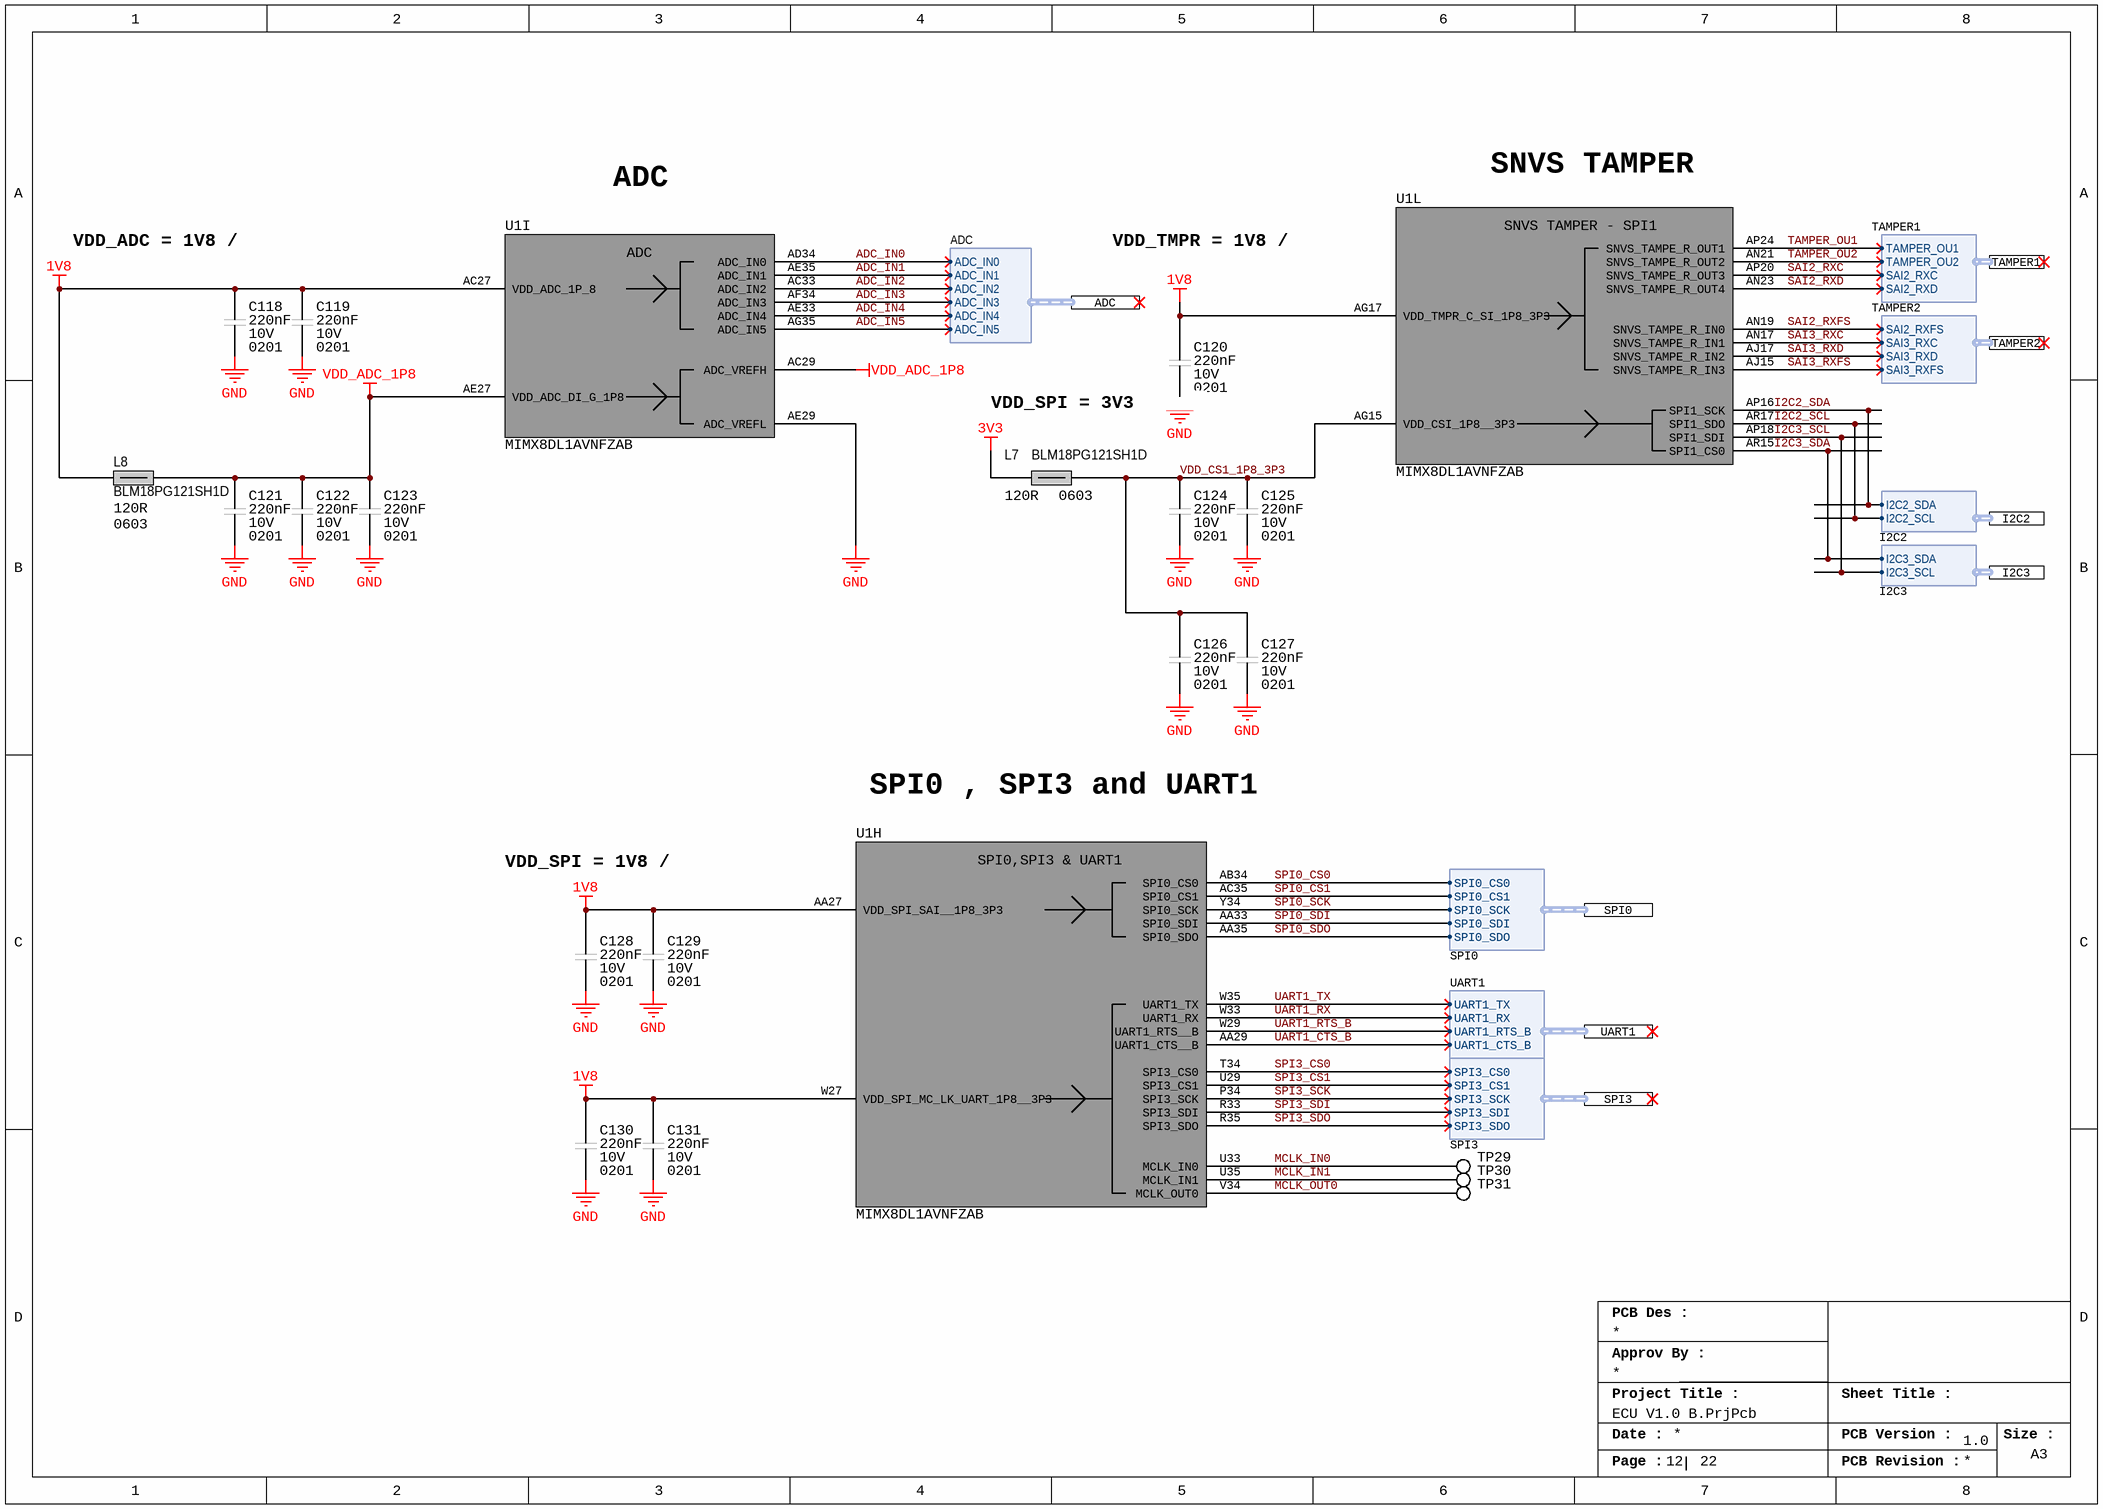
[diagram p8: 11_iMX 8X_SPI & ADC.SchDoc]

### Parts
C118  Voltage Rating (DC): 10V  Capacitance: 220nF  Case/Package: 0201  [CAP_0201_CAPC0603X03N]  (hidden comment: LMK063BJ224MP-F)
C119  Voltage Rating (DC): 10V  Capacitance: 220nF  Case/Package: 0201  [CAP_0201_CAPC0603X03N]  (hidden comment: LMK063BJ224MP-F)
C120  Voltage Rating (DC): 10V  Capacitance: 220nF  Case/Package: 0201  [CAP_0201_CAPC0603X03N]  (hidden comment: LMK063BJ224MP-F)
C121  Voltage Rating (DC): 10V  Capacitance: 220nF  Case/Package: 0201  [CAP_0201_CAPC0603X03N]  (hidden comment: LMK063BJ224MP-F)
C122  Voltage Rating (DC): 10V  Capacitance: 220nF  Case/Package: 0201  [CAP_0201_CAPC0603X03N]  (hidden comment: LMK063BJ224MP-F)
C123  Voltage Rating (DC): 10V  Capacitance: 220nF  Case/Package: 0201  [CAP_0201_CAPC0603X03N]  (hidden comment: LMK063BJ224MP-F)
C124  Voltage Rating (DC): 10V  Capacitance: 220nF  Case/Package: 0201  [CAP_0201_CAPC0603X03N]  (hidden comment: LMK063BJ224MP-F)
C125  Voltage Rating (DC): 10V  Capacitance: 220nF  Case/Package: 0201  [CAP_0201_CAPC0603X03N]  (hidden comment: LMK063BJ224MP-F)
C126  Voltage Rating (DC): 10V  Capacitance: 220nF  Case/Package: 0201  [CAP_0201_CAPC0603X03N]  (hidden comment: LMK063BJ224MP-F)
C127  Voltage Rating (DC): 10V  Capacitance: 220nF  Case/Package: 0201  [CAP_0201_CAPC0603X03N]  (hidden comment: LMK063BJ224MP-F)
C128  Voltage Rating (DC): 10V  Capacitance: 220nF  Case/Package: 0201  [CAP_0201_CAPC0603X03N]  (hidden comment: LMK063BJ224MP-F)
C129  Voltage Rating (DC): 10V  Capacitance: 220nF  Case/Package: 0201  [CAP_0201_CAPC0603X03N]  (hidden comment: LMK063BJ224MP-F)
C130  Voltage Rating (DC): 10V  Capacitance: 220nF  Case/Package: 0201  [CAP_0201_CAPC0603X03N]  (hidden comment: LMK063BJ224MP-F)
C131  Voltage Rating (DC): 10V  Capacitance: 220nF  Case/Package: 0201  [CAP_0201_CAPC0603X03N]  (hidden comment: LMK063BJ224MP-F)
L7  BLM18PG121SH1D  Impedance: 120R  Case/Package: 0603  [IND_0603_INDC1608X08N]
L8  BLM18PG121SH1D  Impedance: 120R  Case/Package: 0603  [IND_0603_INDC1608X08N]
TP29  NO COMPONENT  [TP_PAD_0.5MM_SMD_ROUND]  (value not drawn)  (no BOM)
TP30  NO COMPONENT  [TP_PAD_0.5MM_SMD_ROUND]  (value not drawn)  (no BOM)
TP31  NO COMPONENT  [TP_PAD_0.5MM_SMD_ROUND]  (value not drawn)  (no BOM)
U1  MIMX8DL1AVNFZAB  [MIMX8DL1AVNFZAB]  (parts H,I,L of 15)

### Ports
ADC (harness ADC), I2C2 (harness I2C2), I2C3 (harness I2C3), SPI0 (harness SPI0), SPI3 (harness SPI3), TAMPER1 (harness TAMPER1), TAMPER2 (harness TAMPER2), UART1 (harness UART1)

### Harnesses
SPI0: SPI0_CS0, SPI0_CS1, SPI0_SCK, SPI0_SDI, SPI0_SDO
SPI3: SPI3_CS0, SPI3_CS1, SPI3_SCK, SPI3_SDI, SPI3_SDO
UART1: UART1_TX, UART1_RX, UART1_RTS_B, UART1_CTS_B
TAMPER1: TAMPER_OU1, TAMPER_OU2, SAI2_RXC, SAI2_RXD
TAMPER2: SAI2_RXFS, SAI3_RXC, SAI3_RXD, SAI3_RXFS
ADC: ADC_IN0, ADC_IN1, ADC_IN2, ADC_IN3, ADC_IN4, ADC_IN5
I2C2: I2C2_SDA, I2C2_SCL
I2C3: I2C3_SDA, I2C3_SCL

### Nets
1V8: C118.2 C119.2 C120.2 C128.2 C129.2 C130.2 C131.2 L8.1 U1.AA27(VDD_SPI_SAI__1P8_3P3) U1.AC27(VDD_ADC_1P_8) U1.AG17(VDD_TMPR_C_SI_1P8_3P3) U1.W27(VDD_SPI_MC_LK_UART_1P8__3P3)
3V3: L7.1
GND: C118.1 C119.1 C120.1 C121.1 C122.1 C123.1 C124.1 C125.1 C126.1 C127.1 C128.1 C129.1 C130.1 C131.1 U1.AE29(ADC_VREFL)
VDD_ADC_1P8: C121.2 C122.2 C123.2 L8.2 U1.AC29(ADC_VREFH) U1.AE27(VDD_ADC_DI_G_1P8)
ADC_IN0: U1.AD34(ADC_IN0) ; port ADC.ADC_IN0
ADC_IN1: U1.AE35(ADC_IN1) ; port ADC.ADC_IN1
ADC_IN2: U1.AC33(ADC_IN2) ; port ADC.ADC_IN2
ADC_IN3: U1.AF34(ADC_IN3) ; port ADC.ADC_IN3
ADC_IN4: U1.AE33(ADC_IN4) ; port ADC.ADC_IN4
ADC_IN5: U1.AG35(ADC_IN5) ; port ADC.ADC_IN5
I2C2_SCL: U1.AR17(SPI1_SDO) ; port I2C2.I2C2_SCL
I2C2_SDA: U1.AP16(SPI1_SCK) ; port I2C2.I2C2_SDA
I2C3_SCL: U1.AP18(SPI1_SDI) ; port I2C3.I2C3_SCL
I2C3_SDA: U1.AR15(SPI1_CS0) ; port I2C3.I2C3_SDA
MCLK_IN0: TP29.1 U1.U33(MCLK_IN0)
MCLK_IN1: TP30.1 U1.U35(MCLK_IN1)
MCLK_OUT0: TP31.1 U1.V34(MCLK_OUT0)
SAI2_RXC: U1.AP20(SNVS_TAMPE_R_OUT3) ; port TAMPER1.SAI2_RXC
SAI2_RXD: U1.AN23(SNVS_TAMPE_R_OUT4) ; port TAMPER1.SAI2_RXD
SAI2_RXFS: U1.AN19(SNVS_TAMPE_R_IN0) ; port TAMPER2.SAI2_RXFS
SAI3_RXC: U1.AN17(SNVS_TAMPE_R_IN1) ; port TAMPER2.SAI3_RXC
SAI3_RXD: U1.AJ17(SNVS_TAMPE_R_IN2) ; port TAMPER2.SAI3_RXD
SAI3_RXFS: U1.AJ15(SNVS_TAMPE_R_IN3) ; port TAMPER2.SAI3_RXFS
SPI0_CS0: U1.AB34(SPI0_CS0) ; port SPI0.SPI0_CS0
SPI0_CS1: U1.AC35(SPI0_CS1) ; port SPI0.SPI0_CS1
SPI0_SCK: U1.Y34(SPI0_SCK) ; port SPI0.SPI0_SCK
SPI0_SDI: U1.AA33(SPI0_SDI) ; port SPI0.SPI0_SDI
SPI0_SDO: U1.AA35(SPI0_SDO) ; port SPI0.SPI0_SDO
SPI3_CS0: U1.T34(SPI3_CS0) ; port SPI3.SPI3_CS0
SPI3_CS1: U1.U29(SPI3_CS1) ; port SPI3.SPI3_CS1
SPI3_SCK: U1.P34(SPI3_SCK) ; port SPI3.SPI3_SCK
SPI3_SDI: U1.R33(SPI3_SDI) ; port SPI3.SPI3_SDI
SPI3_SDO: U1.R35(SPI3_SDO) ; port SPI3.SPI3_SDO
TAMPER_OU1: U1.AP24(SNVS_TAMPE_R_OUT1) ; port TAMPER1.TAMPER_OU1
TAMPER_OU2: U1.AN21(SNVS_TAMPE_R_OUT2) ; port TAMPER1.TAMPER_OU2
UART1_CTS_B: U1.AA29(UART1_CTS__B) ; port UART1.UART1_CTS_B
UART1_RTS_B: U1.W29(UART1_RTS__B) ; port UART1.UART1_RTS_B
UART1_RX: U1.W33(UART1_RX) ; port UART1.UART1_RX
UART1_TX: U1.W35(UART1_TX) ; port UART1.UART1_TX
VDD_CS1_1P8_3P3: C124.2 C125.2 C126.2 C127.2 L7.2 U1.AG15(VDD_CSI_1P8__3P3)

### Notes on the sheet
- SNVS TAMPER
- VDD_ADC = 1V8 / 2.5A
- ADC
- VDD_TMPR = 1V8 / 2.5A
- (near C120) VDD_SPI = 3V3
- SPI0 , SPI3 and UART1
- VDD_SPI = 1V8 / 2.5A
- PCB Des :
- Approv By :
- Project Title :
- Sheet Title :
- Date :
- PCB Version :
- Size :
- A3
- Page :
- PCB Revision :
- (in symbol IC_MPU_ARM_1.2GHz_MIMX8DL1AVNFZAB, part H) SPI0,SPI3 & UART1
- (in symbol IC_MPU_ARM_1.2GHz_MIMX8DL1AVNFZAB, part I) ADC
- (in symbol IC_MPU_ARM_1.2GHz_MIMX8DL1AVNFZAB, part L) SNVS TAMPER - SPI1

### Library data of the parts
C118-C131 = CAP_0.22UF_10V_X5R_0201: as C201-C204 on sheet 16_LPDDR; Supplier 1: Digikey; Manufacturer Part Number: LMK063BJ224MP-F; RoHS: Yes; Category: Ceramic Capacitors; Stock 1: 6053224; Pricing 1: 1=0.12, 10=0.08, 50=0.0478, 100=0.0375, 500=0.02772, 1000=0.02295, 2500=0.02136, 5000=0.01954 (USD); Mount: Surface Mount; Case Code (Metric): 0603; Case Code (Imperial): 0201; Min Operating Temperature: -55°C; Max Operating Temperature: 85°C; Voltage Rating: 10V; Packaging: Tape and Reel; Package Quantity: 15000; Dielectric: X5R; Termination: SMD/SMT; Voltage: 10V; Series: M; Construction: Flat; Length: 0.6mm; Width: 0.3mm; Height: 0.3mm; Depth: 0.3mm; Radiation Hardening: No; Halogen Free: Halogen Free; RoHS Compliant: Yes; Reach SVHC Compliant: Unknown; ComponentLink1URL: https://datasheet.ciiva.com/134/lmk063bj224mp-f-ss-134995.pdf?src-supplier=Digikey; ComponentLink1Description: https://datasheet.ciiva.com/134/lmk063bj224mp-f-ss-134995.pdf?src-supplier=Digikey; ComponentLink2URL: https://datasheet.ciiva.com/11464/lmk063bj224mp-f-ss-11464053.pdf?src-supplier=Avnet; ComponentLink2Description: https://datasheet.ciiva.com/11464/lmk063bj224mp-f-ss-11464053.pdf?src-supplier=Avnet; ComponentLink3URL: https://datasheet.ciiva.com/15921/1589lmk063bj224mp-f-15921250.pdf?src-supplier=Onlinecomponents.com; ComponentLink3Description: https://datasheet.ciiva.com/15921/1589lmk063bj224mp-f-15921250.pdf?src-supplier=Onlinecomponents.com; ComponentLink4URL: https://datasheet.ciiva.com/26872/getdatasheetpartid-639019-26872592.pdf?src-supplier=Verical; ComponentLink4Description: https://datasheet.ciiva.com/26872/getdatasheetpartid-639019-26872592.pdf?src-supplier=Verical; ComponentLink5URL: https://datasheet.ciiva.com/30243/100lmk063bj224mp-f-30243150.pdf?src-supplier=Onlinecomponents.com; ComponentLink5Description: https://datasheet.ciiva.com/30243/100lmk063bj224mp-f-30243150.pdf?src-supplier=Onlinecomponents.com; ComponentLink6URL: https://datasheet.ciiva.com/28645/746258-28645141.pdf?src-supplier=Element14; ComponentLink6Description: https://datasheet.ciiva.com/28645/746258-28645141.pdf?src-supplier=Element14; ComponentLink7URL: https://datasheet.ciiva.com/5422/mlcc-all-e-541559-5422365.pdf?src-supplier=Mouser; ComponentLink7Description: https://datasheet.ciiva.com/5422/mlcc-all-e-541559-5422365.pdf?src-supplier=Mouser; Supplier Part Number 1: 587-2483-1-ND
L7 L8 = IND_FERRITE_BEADS_120R_2A_0603_BLM18PG121SH1D: as L6 on sheet 07_iMX 8X_LPDDR4; Supplier 1: Digi-Key; Manufacturer Part Number: BLM18PG121SH1D; RoHS: Yes; Category: Ferrite Beads and Chips; Stock 1: 282143; Pricing 1: 1=0.11, 10=0.086, 25=0.0772, 50=0.0566, 100=0.0489, 250=0.03864, 500=0.03262, 1000=0.02747 (USD); Mount: Surface Mount; Case Code (Metric): 1608; Case Code (Imperial): 0603; Weight: 7.1E-05oz; Contact Plating: Tin,Matte; Material: Ferrite; Min Operating Temperature: -55°C; Max Operating Temperature: 125°C; Tolerance: 25%; Packaging: Tape and Reel; Package Quantity: 1; Current Rating: 2A; Max Current Rating: 2A; Termination: SMD/SMT; Max DC Current: 2A; Test Frequency: 100MHz; Number of Circuits: 1; Series: EMIFIL®, BLM18P; Length: 1.6mm; Width: 0.031inch; Height: 0.8mm; Depth: 0.8mm; Ratings: AEC-Q200; Lead Free: Lead Free; RoHS Compliant: Yes; ComponentLink1URL: https://datasheet.octopart.com/BLM18PG121SH1D-Murata-datasheet-141273661.pdf?src-supplier=Element14; ComponentLink1Description: https://datasheet.octopart.com/BLM18PG121SH1D-Murata-datasheet-141273661.pdf?src-supplier=Element14; ComponentLink2URL: https://datasheet.octopart.com/BLM18PG121SH1D-Murata-datasheet-62086335.pdf?src-supplier=Future+Electronics; ComponentLink2Description: https://datasheet.octopart.com/BLM18PG121SH1D-Murata-datasheet-62086335.pdf?src-supplier=Future+Electronics; ComponentLink3URL: http://search.murata.co.jp/Ceramy/image/img/PDF/ENG/L0132S0193BLM18P.pdf?src-supplier=Avnet; ComponentLink3Description: http://search.murata.co.jp/Ceramy/image/img/PDF/ENG/L0132S0193BLM18P.pdf?src-supplier=Avnet; ComponentLink4URL: https://www.murata.com/en-us/products/productdata/8796738650142/ENFA0003.pdf?src-supplier=Digi-Key; ComponentLink4Description: https://www.murata.com/en-us/products/productdata/8796738650142/ENFA0003.pdf?src-supplier=Digi-Key; Supplier Part Number 1: 490-7815-6-ND
TP29-TP31 = TP_PAD_SMD_SMALL: as TP34-TP38 on sheet 02_PWR IN
U1 = IC_MPU_ARM_1.2GHz_MIMX8DL1AVNFZAB: as U1 on sheet 07_iMX 8X_LPDDR4; Supplier 1: Mouser; Manufacturer Part Number: MIMX8DL1AVNFZAB; RoHS: No; Category: Uncategorized; Stock 1: 196; Pricing 1: 1=46.19, 10=40.26, 25=38.57, 50=38.56, 100=33.3, 252=33.16, 1000=33.3, 10000=33.3 (USD); Supplier Part Number 1: 771-MIMX8DL1AVNFZAB